# Altium project Kasli.PrjPCB (part 5 of 6)

## Sheet FPGA_I2C.SchDoc: =ProjectName
size 420 x 297 mm; Author: Paweł Kulik; CompanyName: WUT; DrawnBy: Paweł Kulik; Organization: WUT ISE; Address1: Warsaw Univeristy of Technology; Address2: Nowowiejska 15/19; DocumentNumber: 11; Revision: 2.0.1; SheetNumber: 8; SheetTotal: 11; EDA_Number: ARTIQ; Projet: ARTIQ/SINARA; ModifiedBy: -; CheckedDate: -; Title2: FPGA_I2C.SchDoc; DivGrp: ISE; Designer: Paweł Kulik; ModifiedDate: -; ProjectName: ARTIQ/SINARA
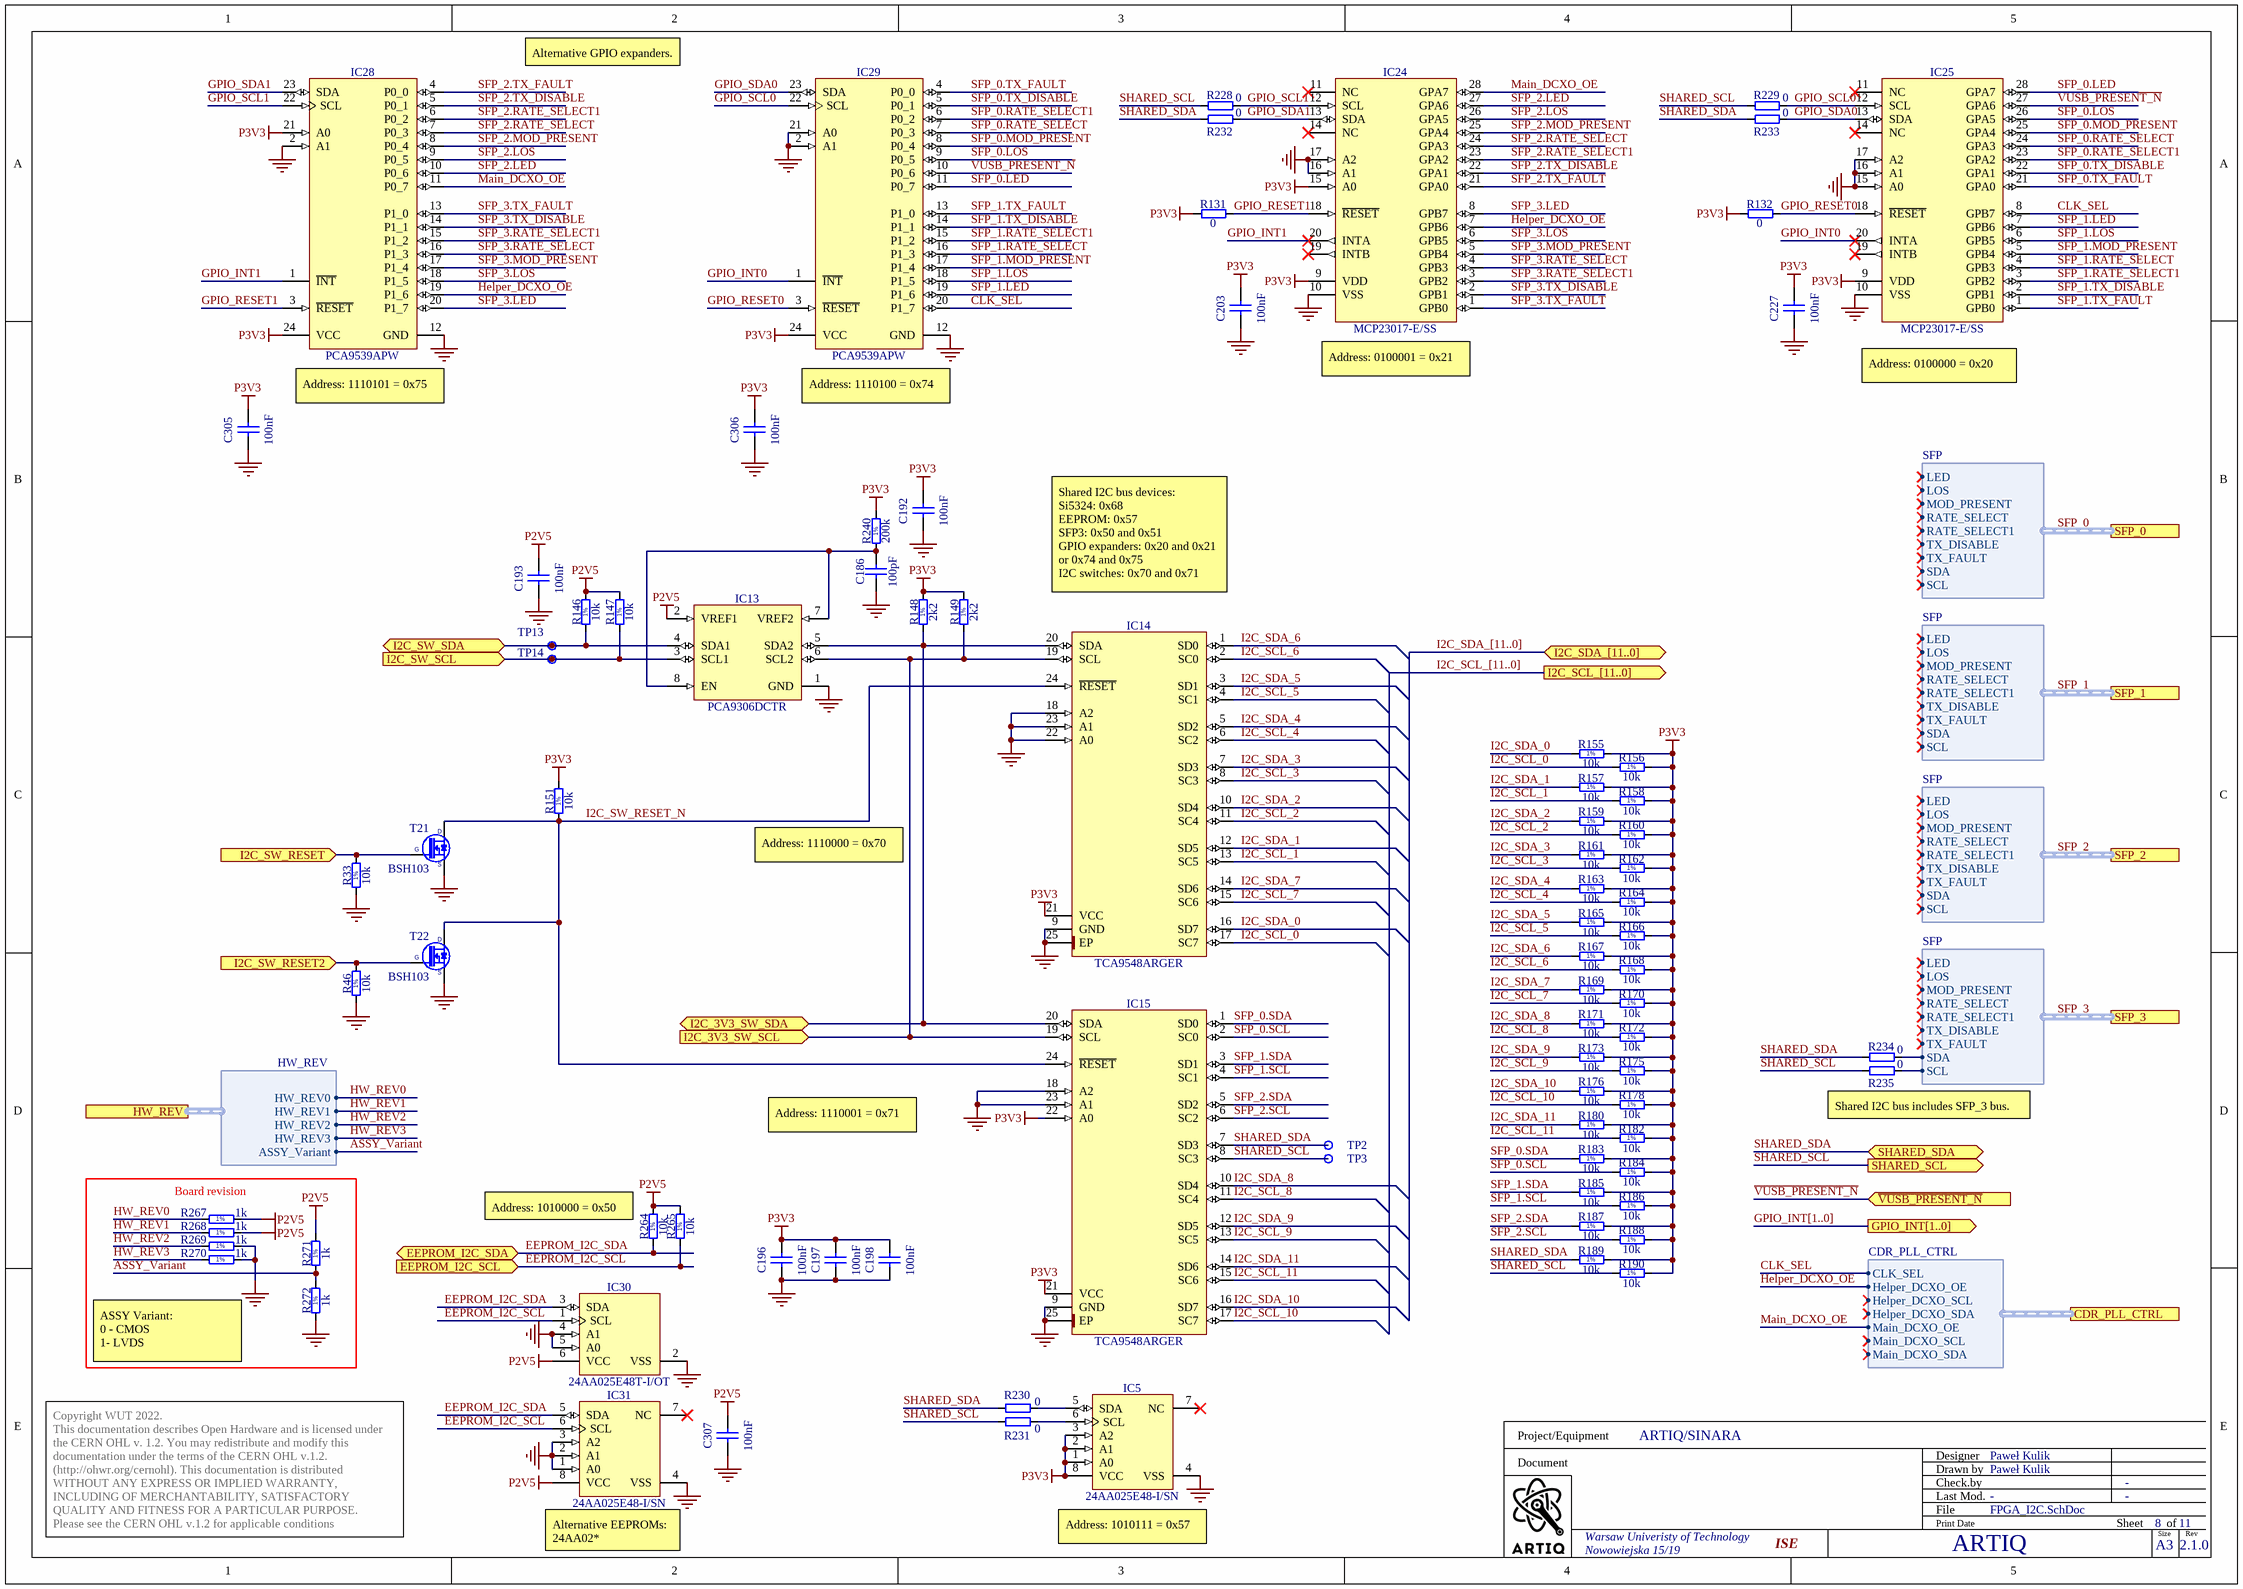
[diagram p7: FPGA_I2C.SchDoc]

### Parts
C186  100pF  [CAPC1005X55N]
C192  100nF  [CAPC0603X33N]
C193  100nF  [CAPC0603X33N]
C196  100nF  [CAPC0603X33N]
C197  100nF  [CAPC0603X33N]
C198  100nF  [CAPC0603X33N]
C203  100nF  [CAPC0603X33N]
C227  100nF  [CAPC0603X33N]
C305  100nF  [CAPC0603X33N]
C306  100nF  [CAPC0603X33N]
C307  100nF  [CAPC1005X55N]
IC5  24AA025E48-I/SN  [SOIC127P600X175-8N]
IC13  PCA9306DCTR  [SOP65P400X130-8N]
IC14  TCA9548ARGER  [QFN50P400X400X100-25N-S220]
IC15  TCA9548ARGER  [QFN50P400X400X100-25N-S220]
IC24  MCP23017-E/SS  [SOP65P780X200-28N]
IC25  MCP23017-E/SS  [SOP65P780X200-28N]
IC28  PCA9539APW  [SOP65P640X110-24N]
IC29  PCA9539APW  [SOP65P640X110-24N]
IC30  24AA025E48T-I/OT  [SOT95P280X145-6N]
IC31  24AA025E48-I/SN  [SOIC127P600X175-8N]
R33  10k  [RESC1005X40N]
R46  10k  [RESC1005X40N]
R131  0  [RESC1005X40N]
R132  0  [RESC1005X40N]
R146  10k  [RESC1005X40N]
R147  10k  [RESC1005X40N]
R148  2k2  [RESC1005X40N]
R149  2k2  [RESC1005X40N]
R151  10k  [RESC1005X40N]
R155  10k  [RESC1005X40N]
R156  10k  [RESC1005X40N]
R157  10k  [RESC1005X40N]
R158  10k  [RESC1005X40N]
R159  10k  [RESC1005X40N]
R160  10k  [RESC1005X40N]
R161  10k  [RESC1005X40N]
R162  10k  [RESC1005X40N]
R163  10k  [RESC1005X40N]
R164  10k  [RESC1005X40N]
R165  10k  [RESC1005X40N]
R166  10k  [RESC1005X40N]
R167  10k  [RESC1005X40N]
R168  10k  [RESC1005X40N]
R169  10k  [RESC1005X40N]
R170  10k  [RESC1005X40N]
R171  10k  [RESC1005X40N]
R172  10k  [RESC1005X40N]
R173  10k  [RESC1005X40N]
R175  10k  [RESC1005X40N]
R176  10k  [RESC1005X40N]
R178  10k  [RESC1005X40N]
R180  10k  [RESC1005X40N]
R182  10k  [RESC1005X40N]
R183  10k  [RESC1005X40N]
R184  10k  [RESC1005X40N]
R185  10k  [RESC1005X40N]
R186  10k  [RESC1005X40N]
R187  10k  [RESC1005X40N]
R188  10k  [RESC1005X40N]
R189  10k  [RESC1005X40N]
R190  10k  [RESC1005X40N]
R228  0  [RESC1005X40N]
R229  0  [RESC1005X40N]
R230  0  [RESC1005X40N]
R231  0  [RESC1005X40N]
R232  0  [RESC1005X40N]
R233  0  [RESC1005X40N]
R234  0  [RESC1005X40N]
R235  0  [RESC1005X40N]
R240  200k  [RESC1005X40N]
R264  10k  [RESC1005X40N]
R265  10k  [RESC1005X40N]
R267  1k  [RESC1005X40N]
R268  1k  [RESC1005X40N]
R269  1k  [RESC1005X40N]
R270  1k  [RESC1005X40N]
R271  1k  [RESC1005X40N]
R272  1k  [RESC1005X40N]
T21  BSH103  [SOT95P230X110-3N]
T22  BSH103  [SOT95P230X110-3N]
TP2  Si5324 I2C SDA  [TPS127]  (value not drawn)
TP3  Si5324 I2C SCL  [TPS127]  (value not drawn)
TP13  I2C SW SDA  [TPS127]  (value not drawn)
TP14  I2C SW SCL  [TPS127]  (value not drawn)

### Blocks framed on the sheet
Board revision: R267-R272

### Ports
CDR_PLL_CTRL (harness CDR_PLL_CTRL), EEPROM_I2C_SCL (in), EEPROM_I2C_SDA (bidir), GPIO_INT[1..0] (out), HW_REV (harness HW_REV), I2C_3V3_SW_SCL (in), I2C_3V3_SW_SDA (bidir), I2C_SCL_[11..0] (out), I2C_SDA_[11..0] (bidir), I2C_SW_RESET2 (in), I2C_SW_RESET (in), I2C_SW_SCL (in), I2C_SW_SDA (bidir), SFP_0 (harness SFP), SFP_1 (harness SFP), SFP_2 (harness SFP), SFP_3 (harness SFP), SHARED_SCL (out), SHARED_SDA (bidir), ~{VUSB_PRESENT_N} (in)

### Harnesses
SFP: LED, LOS, MOD_PRESENT, RATE_SELECT, RATE_SELECT1, TX_DISABLE, TX_FAULT, SDA, SCL
CDR_PLL_CTRL: CLK_SEL, Helper_DCXO_OE, Helper_DCXO_SCL, Helper_DCXO_SDA, Main_DCXO_OE, Main_DCXO_SCL, Main_DCXO_SDA
HW_REV: ASSY_Variant, HW_REV3, HW_REV2, HW_REV1, HW_REV0

### Nets
GND: C186.1 C192.1 C193.1 C196.1 C197.1 C198.1 C203.1 C227.1 C305.1 C306.1 C307.1 IC5.4(VSS) IC13.1(GND) IC14.9(GND) IC14.18(A2) IC14.22(A0) IC14.23(A1) IC14.25(EP) IC15.9(GND) IC15.18(A2) IC15.23(A1) IC15.25(EP) IC24.10(VSS) IC24.16(A1) IC24.17(A2) IC25.10(VSS) IC25.15(A0) IC25.16(A1) IC25.17(A2) IC28.2(A1) IC28.12(GND) IC29.2(A1) IC29.12(GND) IC29.21(A0) IC30.2(VSS) IC30.4(A1) IC30.5(A0) IC31.1(A0) IC31.2(A1) IC31.3(A2) IC31.4(VSS) R33.1 R46.1 R269.2 R270.2 R272.1 T21.2(S) T22.2(S)
P2V5: C193.2 C307.2 IC13.2(VREF1) IC30.6(VCC) IC31.8(VCC) R146.2 R147.2 R264.2 R265.2 R267.2 R268.2 R271.2
P3V3: C192.2 C196.2 C197.2 C198.2 C203.2 C227.2 C305.2 C306.2 IC5.1(A0) IC5.2(A1) IC5.3(A2) IC5.8(VCC) IC14.21(VCC) IC15.21(VCC) IC15.22(A0) IC24.9(VDD) IC24.15(A0) IC25.9(VDD) IC28.21(A0) IC28.24(VCC) IC29.24(VCC) R131.1 R132.1 R148.2 R149.2 R151.2 R155.2 R156.2 R157.2 R158.2 R159.2 R160.2 R161.2 R162.2 R163.2 R164.2 R165.2 R166.2 R167.2 R168.2 R169.2 R170.2 R171.2 R172.2 R173.2 R175.2 R176.2 R178.2 R180.2 R182.2 R183.2 R184.2 R185.2 R186.2 R187.2 R188.2 R189.2 R190.2 R240.2
~{VUSB_PRESENT_N}: IC25.27(GPA6) IC29.10(P0_6) ; port ~{VUSB_PRESENT_N}
ASSY_Variant: R271.1 R272.2 ; port HW_REV.ASSY_Variant
CLK_SEL: IC25.8(GPB7) IC29.20(P1_7) ; port CDR_PLL_CTRL.CLK_SEL
EEPROM_I2C_SCL: IC30.1(SCL) IC31.6(SCL) R265.1 ; port EEPROM_I2C_SCL
EEPROM_I2C_SDA: IC30.3(SDA) IC31.5(SDA) R264.1 ; port EEPROM_I2C_SDA
GPIO_INT0: IC25.20(INTA) IC29.1(~{INT})
GPIO_INT1: IC24.20(INTA) IC28.1(~{INT})
GPIO_RESET0: IC25.18(~{RESET}) IC29.3(~{RESET}) R132.2
GPIO_RESET1: IC24.18(~{RESET}) IC28.3(~{RESET}) R131.2
GPIO_SCL0: IC25.12(SCL) IC29.22(SCL) R229.2
GPIO_SCL1: IC24.12(SCL) IC28.22(SCL) R228.2
GPIO_SDA0: IC25.13(SDA) IC29.23(SDA) R233.2
GPIO_SDA1: IC24.13(SDA) IC28.23(SDA) R232.2
Helper_DCXO_OE: IC24.7(GPB6) IC28.19(P1_6) ; port CDR_PLL_CTRL.Helper_DCXO_OE
HW_REV0: R267.1 ; port HW_REV.HW_REV0
HW_REV1: R268.1 ; port HW_REV.HW_REV1
HW_REV2: R269.1 ; port HW_REV.HW_REV2
HW_REV3: R270.1 ; port HW_REV.HW_REV3
I2C_3V3_SW_SCL: IC13.6(SCL2) IC14.19(SCL) IC15.19(SCL) R149.1 ; port I2C_3V3_SW_SCL
I2C_3V3_SW_SDA: IC13.5(SDA2) IC14.20(SDA) IC15.20(SDA) R148.1 ; port I2C_3V3_SW_SDA
I2C_SCL_0: IC14.17(SC7) R156.1
I2C_SCL_1: IC14.13(SC5) R158.1
I2C_SCL_2: IC14.11(SC4) R160.1
I2C_SCL_3: IC14.8(SC3) R162.1
I2C_SCL_4: IC14.6(SC2) R164.1
I2C_SCL_5: IC14.4(SC1) R166.1
I2C_SCL_6: IC14.2(SC0) R168.1
I2C_SCL_7: IC14.15(SC6) R170.1
I2C_SCL_8: IC15.11(SC4) R172.1
I2C_SCL_9: IC15.13(SC5) R175.1
I2C_SCL_10: IC15.17(SC7) R178.1
I2C_SCL_11: IC15.15(SC6) R182.1
I2C_SDA_0: IC14.16(SD7) R155.1
I2C_SDA_1: IC14.12(SD5) R157.1
I2C_SDA_2: IC14.10(SD4) R159.1
I2C_SDA_3: IC14.7(SD3) R161.1
I2C_SDA_4: IC14.5(SD2) R163.1
I2C_SDA_5: IC14.3(SD1) R165.1
I2C_SDA_6: IC14.1(SD0) R167.1
I2C_SDA_7: IC14.14(SD6) R169.1
I2C_SDA_8: IC15.10(SD4) R171.1
I2C_SDA_9: IC15.12(SD5) R173.1
I2C_SDA_10: IC15.16(SD7) R176.1
I2C_SDA_11: IC15.14(SD6) R180.1
I2C_SW_RESET: R33.2 T21.1(G) ; port I2C_SW_RESET
I2C_SW_RESET2: R46.2 T22.1(G) ; port I2C_SW_RESET2
I2C_SW_RESET_N: IC14.24(~{RESET}) IC15.24(~{RESET}) R151.1 T21.3(D) T22.3(D)
I2C_SW_SCL: IC13.3(SCL1) R147.1 TP14.1 ; port I2C_SW_SCL
I2C_SW_SDA: IC13.4(SDA1) R146.1 TP13.1 ; port I2C_SW_SDA
Main_DCXO_OE: IC24.28(GPA7) IC28.11(P0_7) ; port CDR_PLL_CTRL.Main_DCXO_OE
SFP_0.LED: IC25.28(GPA7) IC29.11(P0_7)
SFP_0.LOS: IC25.26(GPA5) IC29.9(P0_5)
SFP_0.MOD_PRESENT: IC25.25(GPA4) IC29.8(P0_4)
SFP_0.RATE_SELECT: IC25.24(GPA3) IC29.7(P0_3)
SFP_0.RATE_SELECT1: IC25.23(GPA2) IC29.6(P0_2)
SFP_0.SCL: IC15.2(SC0) R184.1
SFP_0.SDA: IC15.1(SD0) R183.1
SFP_0.TX_DISABLE: IC25.22(GPA1) IC29.5(P0_1)
SFP_0.TX_FAULT: IC25.21(GPA0) IC29.4(P0_0)
SFP_1.LED: IC25.7(GPB6) IC29.19(P1_6)
SFP_1.LOS: IC25.6(GPB5) IC29.18(P1_5)
SFP_1.MOD_PRESENT: IC25.5(GPB4) IC29.17(P1_4)
SFP_1.RATE_SELECT: IC25.4(GPB3) IC29.16(P1_3)
SFP_1.RATE_SELECT1: IC25.3(GPB2) IC29.15(P1_2)
SFP_1.SCL: IC15.4(SC1) R186.1
SFP_1.SDA: IC15.3(SD1) R185.1
SFP_1.TX_DISABLE: IC25.2(GPB1) IC29.14(P1_1)
SFP_1.TX_FAULT: IC25.1(GPB0) IC29.13(P1_0)
SFP_2.LED: IC24.27(GPA6) IC28.10(P0_6)
SFP_2.LOS: IC24.26(GPA5) IC28.9(P0_5)
SFP_2.MOD_PRESENT: IC24.25(GPA4) IC28.8(P0_4)
SFP_2.RATE_SELECT: IC24.24(GPA3) IC28.7(P0_3)
SFP_2.RATE_SELECT1: IC24.23(GPA2) IC28.6(P0_2)
SFP_2.SCL: IC15.6(SC2) R188.1
SFP_2.SDA: IC15.5(SD2) R187.1
SFP_2.TX_DISABLE: IC24.22(GPA1) IC28.5(P0_1)
SFP_2.TX_FAULT: IC24.21(GPA0) IC28.4(P0_0)
SFP_3.LED: IC24.8(GPB7) IC28.20(P1_7)
SFP_3.LOS: IC24.6(GPB5) IC28.18(P1_5)
SFP_3.MOD_PRESENT: IC24.5(GPB4) IC28.17(P1_4)
SFP_3.RATE_SELECT: IC24.4(GPB3) IC28.16(P1_3)
SFP_3.RATE_SELECT1: IC24.3(GPB2) IC28.15(P1_2)
SFP_3.SCL: R235.2 ; port SFP_3.SCL
SFP_3.SDA: R234.2 ; port SFP_3.SDA
SFP_3.TX_DISABLE: IC24.2(GPB1) IC28.14(P1_1)
SFP_3.TX_FAULT: IC24.1(GPB0) IC28.13(P1_0)
SHARED_SCL: IC15.8(SC3) R190.1 R228.1 R229.1 R231.1 R235.1 TP3.1 ; port SHARED_SCL
SHARED_SDA: IC15.7(SD3) R189.1 R230.1 R232.1 R233.1 R234.1 TP2.1 ; port SHARED_SDA
NetC186_2: C186.2 IC13.7(VREF2) IC13.8(EN) R240.1
NetIC5_5: IC5.5(SDA) R230.2
NetIC5_6: IC5.6(SCL) R231.2

Not connected (* = marked no-connect by the designer): IC5 7(NC)*; IC24 11(NC)* 14(NC)* 19(INTB)*; IC25 11(NC)* 14(NC)* 19(INTB)*; IC31 7(NC)*

### Buses and harness runs
bus GPIO_INT[1..0] = port GPIO_INT[1..0]
bus I2C_SCL_[11..0] = port I2C_SCL_[11..0]
bus I2C_SDA_[11..0] = port I2C_SDA_[11..0]
harness SFP_0 = port SFP_0
harness SFP_1 = port SFP_1
harness SFP_2 = port SFP_2
harness SFP_3 = port SFP_3

### Notes on the sheet
- Alternative GPIO expanders.
- Address: 1110101 = 0x75
- Address: 1110100 = 0x74
- (near IC24) Address: 0100001 = 0x21
- (near IC25) Address: 0100000 = 0x20
- Shared I2C bus devices:
  Si5324: 0x68
  EEPROM: 0x57
  SFP3: 0x50 and 0x51
  GPIO expanders: 0x20 and 0x21 or 0x74 and 0x75
  I2C switches: 0x70 and 0x71
- Address: 1110000 = 0x70
- Address: 1110001 = 0x71
- Shared I2C bus includes SFP_3 bus.
- (near R264) Address: 1010000 = 0x50
- ASSY Variant:
  0 - CMOS
  1- LVDS
- (near IC5) Address: 1010111 = 0x57
- (near IC31) Alternative EEPROMs:
  24AA02*
- Project/Equipment
- Document
- Designer
- Drawn by
- Check.by
- Copyright WUT 2022.
  This documentation describes Open Hardware and is licensed under the CERN OHL v. 1.2. You may redistribute and modify this documentation under the terms of the CERN OHL v.1.2. (http://ohwr.org/cernohl). This documentation is distributed WITHOUT ANY EXPRESS OR IMPLIED WARRANTY, INCLUDING OF MERCHANTABILITY, SATISFACTORY QUALITY AND FITNESS FOR A PARTICULAR PURPOSE. Please see the CERN OHL v.1.2 for applicable conditions
- File
- Last Mod.
- Print Date
- Sheet
- Size
- A3
- of
- Rev
- (in symbol R0402_1K_1%_0.0625W_100PPM) 1%
- (in symbol R0402_2K2_1%_0.0625W_100PPM) 1%
- (in symbol R0402_10K_1%_0.0625W_100PPM) 1%
- (in symbol R0402_200K_1%_0.0625W_100PPM) 1%

### Library data of the parts
C186 = CC0402_100PF_50V_5%_C0G: Non-polarised capacitor; Part Description: SMD Multilayer Chip Ceramic Capacitor; Manufacturer: GENERIC; Manufacturer1 Part Number: C0402C101J5GACTU; Voltage: 50V; TC: C0G/NP0; Tolerance: ±5%; Part Number: CC0402_100PF_50V_5%_C0G; Component Kind: Standard; Component Type: Standard; Pin Count: 2; Value: 100pF; Status: Preferred; Manufacturer Part Number: CC0402_100PF_50V_5%_C0G; Case: 0402; Mounted: Yes; Socket: No; SMD: Yes; Sense: No; Manufacturer1 Example: KEMET; Manufacturer1 ComponentHeight: 0.55mm; HelpURL: \\cern.ch\dfs\Applications\Altium\Datasheets\CC0805_C0G_KEMET_(Commercial Grade).pdf; Author: CERN DEM JLC; CreateDate: 03.12.2007; LatestRevisionDate: 22.04.2015
C192 C193 C196-C198 C203 C227 C305 C306 = CC0201_100NF_6.3V_10%_X5R: as C160 on sheet SFP; Part Number: CC0201_100NF_6.3V_10%_X5R; Component Kind: Standard; Component Type: Standard; Pin Count: 2; Value: 100nF; Status: Not Recommended; Manufacturer Part Number: CC0201_100NF_6.3V_10%_X5R; Case: 0201; Mounted: Yes; Socket: No; SMD: Yes; Sense: No; Manufacturer1 Example: AVX; Manufacturer1 ComponentHeight: 0.33mm; HelpURL: \\cern.ch\dfs\Applications\Altium\Datasheets\CC0201_X5R_AVX.pdf; Author: CERN DEM JLC; CreateDate: 2007-12-03; LatestRevisionDate: 2007-12-03
C307 = CC0402_100NF_16V_10%_X5R: Non-polarised capacitor; Part Description: SMD Multilayer Chip Ceramic Capacitor; Manufacturer: GENERIC; Manufacturer1 Part Number: GRM155R61C104KA88D; Voltage: 16V; TC: X5R; Tolerance: ±10%; Part Number: CC0402_100NF_16V_10%_X5R; Component Kind: Standard; Component Type: Standard; Pin Count: 2; Value: 100nF; Status: None; Manufacturer Part Number: CC0402_100NF_16V_10%_X5R; Case: 0402; Mounted: Yes; Socket: No; SMD: Yes; Sense: No; Manufacturer1 Example: MURATA; Manufacturer1 ComponentHeight: 0.55mm; HelpURL: \\cern.ch\dfs\Applications\Altium\Datasheets\CC0402_X5R_MURATA_GRM.pdf; Author: CERN DEM JLC; CreateDate: 2013-12-10; LatestRevisionDate: 2013-12-10
IC5 IC31 = 24AA025E48-I/SN: 1.7V-5.5V, 2K I2C™ Serial EEPROMs with EUI-48™ Node Identity; Manufacturer: MICROCHIP TECHNOLOGY; PressFit: No; Bonding: No; Part Number: 24AA025E48-I/SN; Component Kind: Standard; Component Type: Standard; Device: 24AA025E48-I/SN; Part Description: 1.7V-5.5V, 2K I2C™ Serial EEPROMs with EUI-48™ Node Identity; Manufacturer Part Number: 24AA025E48-I/SN; Pin Count: 8; Case: SOIC8; Mounted: Yes; Socket: No; SMD: Yes; Sense: No; ComponentHeight: 1.75mm; HelpURL: \\cern.ch\dfs\Applications\Altium\Datasheets\24AA025E48-I-SN.pdf; Author: CERN DEM MR
  IC5: PackageDescription: SOIC 8, Pitch 1.27mm - Body 4x5mm, IPC Medium Density; CreateDate: 19.07.2016; LatestRevisionDate: 19.07.2016
  IC31: PackageDescription: SOIC, 1.27mm Pitch; 8 Pin - Body 4x5mm, IPC Medium Density; CreateDate: 2016-07-19; LatestRevisionDate: 2016-07-19
IC13 = PCA9306DCTR: Dual Bidirectional I2C Bus And SMBus Voltage-Level Translator; Manufacturer: TEXAS INSTRUMENTS; PressFit: No; Bonding: No; Part Number: PCA9306DCTR; Component Kind: Standard; Component Type: Standard; Device: PCA9306DCTR; PackageDescription: SOP, 0.65mm, Pitch; 8 Pin, 2.80mm W X 2.95mm L X 1.30mm H Body, PC Medium Density; Part Description: Dual Bidirectional I2C Bus And SMBus Voltage-Level Translator; Manufacturer Part Number: PCA9306DCTR; Pin Count: 8; Case: SSOP8; Mounted: Yes; Socket: No; SMD: Yes; Sense: No; ComponentHeight: 1.3mm; Author: CERN DEM JLC; HelpURL: \\cern.ch\dfs\Applications\Altium\Datasheets\PCA9306DCTR.pdf; CreateDate: 25.02.2013; LatestRevisionDate: 11.02.2016
IC14 IC15 = TCA9548ARGER: Low Voltage 8-Channel I2C Switch With Reset; Manufacturer: TEXAS INSTRUMENTS; PressFit: No; Bonding: No; Part Number: TCA9548ARGER; Component Kind: Standard; Component Type: Standard; Device: TCA9548ARGER; PackageDescription: QFN, 0.50mm Pitch, Square; 24 Pin, 4.00mm L X 4.00mm W X 1.00mm H body (w/thermal tab 2.2 X 2.2mm), IPC Medium Density; Part Description: Low Voltage 8-Channel I2C Switch With Reset; Manufacturer Part Number: TCA9548ARGER; Pin Count: 25; Case: QFN24; Mounted: Yes; Socket: No; SMD: Yes; Sense: No; ComponentHeight: 1mm; Author: CERN DEM JLC; HelpURL: \\cern.ch\dfs\Applications\Altium\Datasheets\TCA9548ARGER.pdf; CreateDate: 07.07.2014; LatestRevisionDate: 07.07.2014
IC24 IC25 = MCP23017-E/SS: 16-bit I/O Port Expander With Serial Interface; Manufacturer: MICROCHIP TECHNOLOGY; PressFit: No; Bonding: No; Part Number: MCP23017-E/SS; Component Kind: Standard; Component Type: Standard; Device: MCP23017-E/SS; PackageDescription: SOP, 0.65mm Pitch; 28 pin, 5.30mm W X 10.20mm L X 2.00mm H body, IPC Medium Density; Part Description: 16-bit I/O Port Expander With Serial Interface; Manufacturer Part Number: MCP23017-E/SS; Pin Count: 28; Case: SSOP28; Mounted: Yes; Socket: No; SMD: Yes; Sense: No; ComponentHeight: 2mm; Author: CERN DEM JLC; HelpURL: \\cern.ch\dfs\Applications\Altium\Datasheets\MCP23017-E-SS.pdf; CreateDate: 2011-01-17; LatestRevisionDate: 2011-01-17
IC28 IC29 = PCA9539APW: Low-Voltage 16-Bit I2C-Bus I/O Port with Interrupt and Reset; Manufacturer: NXP SEMICONDUCTORS; PressFit: No; Bonding: No; Part Number: PCA9539APW; Component Kind: Standard; Component Type: Standard; Device: PCA9539APW; PackageDescription: SOP, 0.65mm Pitch; 24 Pin, 4.40mm W X 7.80mm L X 1.10mm H body, IPC Medium Density; Part Description: Low-Voltage 16-Bit I2C-Bus I/O Port with Interrupt and Reset; Manufacturer Part Number: PCA9539APW; Pin Count: 24; Case: TSSOP24; Mounted: Yes; Socket: No; SMD: Yes; Sense: No; ComponentHeight: 1.1mm; Author: CERN DEM JMW; HelpURL: \\cern.ch\dfs\Applications\Altium\Datasheets\PCA9539APW.pdf; CreateDate: 2020-08-06; LatestRevisionDate: 2020-08-06
IC30 = 24AA025E48T-I/OT: 1.7V-5.5V, 2K I2C Serial EEPROM With EUI-48 Node Identity; Part Description: 1.7V-5.5V, 2K I2C Serial EEPROM With EUI-48™ Node Identity; Cascadable; Manufacturer: MICROCHIP TECHNOLOGY; PressFit: No; Bonding: No; Part Number: 24AA025E48T-I/OT; Component Kind: Standard; Component Type: Standard; Device: 24AA025E48T-I/OT; PackageDescription: SOT, 0.95mm pitch; 6 pin, 1.60mm W X 2.90mm L X 1.45mm H body, IPC Medium Density; Manufacturer Part Number: 24AA025E48T-I/OT; Pin Count: 6; Case: SOT23-6; Mounted: Yes; Socket: No; SMD: Yes; Sense: No; ComponentHeight: 1.45mm; HelpURL: \\cern.ch\dfs\Applications\Altium\Datasheets\24AA025E48T-I-OT.pdf; Author: CERN DEM BC; CreateDate: 2019-12-06; LatestRevisionDate: 2019-12-06
R33 R46 R146 R147 R151 R155-R173 R175 R176 R178 R180 R182-R190 R264 R265 = R0402_10K_1%_0.0625W_100PPM: Resistor - 1%; Part Description: General Purpose Thick Film Chip Resistor; Manufacturer: GENERIC; Manufacturer1 Part Number: 232270671003L; TC: ±100ppm/°C; PressFit: No; Part Number: R0402_10K_1%_0.0625W_100PPM; Component Kind: Standard; Component Type: Standard; Pin Count: 2; Value: 10k; Status: Not Recommended; Power: 0.0625W; Tolerance: ±1%; Manufacturer Part Number: R0402_10K_1%_0.0625W_100PPM; Case: 0402; Mounted: Yes; Sense: No; Socket: No; SMD: Yes; Manufacturer1 Example: YAGEO PHYCOMP; Manufacturer1 ComponentHeight: 0.4mm; HelpURL: \\cern.ch\dfs\Applications\Altium\Datasheets\R0402_Phycomp_RC0402.pdf; Author: CERN DEM JLC; CreateDate: 03.12.2007; LatestRevisionDate: 17.10.2012
R131 R132 R228-R235 = R0402_0R_JUMPER: Resistor; Part Description: 1A (0.05R Max DC Resistance) Zero Ohm Jumper; Manufacturer: GENERIC; Manufacturer1 Part Number: 232270591001L; PressFit: No; Part Number: R0402_0R_JUMPER; Component Kind: Standard; Component Type: Standard; Pin Count: 2; Value: 0; Status: Not Recommended; Manufacturer Part Number: R0402_0R_JUMPER; Case: 0402; Mounted: Yes; Sense: No; Socket: No; SMD: Yes; Manufacturer1 Example: YAGEO PHYCOMP; Manufacturer1 ComponentHeight: 0.4mm; HelpURL: \\cern.ch\dfs\Applications\Altium\Datasheets\R0402_Phycomp_RC0402.pdf; Author: CERN DEM JLC
  R131 R132: CreateDate: 2007-12-03; LatestRevisionDate: 2012-10-17
  R228-R235: CreateDate: 03.12.2007; LatestRevisionDate: 17.10.2012
R148 R149 = R0402_2K2_1%_0.0625W_100PPM: Resistor - 1%; Part Description: General Purpose Thick Film Chip Resistor; Manufacturer: GENERIC; Manufacturer1 Part Number: 232270672202L; TC: ±100ppm/°C; PressFit: No; Part Number: R0402_2K2_1%_0.0625W_100PPM; Component Kind: Standard; Component Type: Standard; Pin Count: 2; Value: 2k2; Status: Not Recommended; Power: 0.0625W; Tolerance: ±1%; Manufacturer Part Number: R0402_2K2_1%_0.0625W_100PPM; Case: 0402; Mounted: Yes; Sense: No; Socket: No; SMD: Yes; Manufacturer1 Example: YAGEO PHYCOMP; Manufacturer1 ComponentHeight: 0.4mm; HelpURL: \\cern.ch\dfs\Applications\Altium\Datasheets\R0402_Phycomp_RC0402.pdf; Author: CERN DEM JLC; CreateDate: 03.12.2007; LatestRevisionDate: 17.10.2012
R240 = R0402_200K_1%_0.0625W_100PPM: Resistor - 1%; Part Description: General Purpose Thick Film Chip Resistor; Manufacturer: GENERIC; Manufacturer1 Part Number: 232270672004L; TC: ±100ppm/°C; PressFit: No; Part Number: R0402_200K_1%_0.0625W_100PPM; Component Kind: Standard; Component Type: Standard; Pin Count: 2; Value: 200k; Status: Not Recommended; Power: 0.0625W; Tolerance: ±1%; Manufacturer Part Number: R0402_200K_1%_0.0625W_100PPM; Case: 0402; Mounted: Yes; Sense: No; Socket: No; SMD: Yes; Manufacturer1 Example: YAGEO PHYCOMP; Manufacturer1 ComponentHeight: 0.4mm; HelpURL: \\cern.ch\dfs\Applications\Altium\Datasheets\R0402_Phycomp_RC0402.pdf; Author: CERN DEM JLC; CreateDate: 03.12.2007; LatestRevisionDate: 17.10.2012
R267-R272 = R0402_1K_1%_0.0625W_100PPM: Resistor - 1%; Part Description: General Purpose Thick Film Chip Resistor; Manufacturer: GENERIC; Manufacturer1 Part Number: 232270671002L; TC: ±100ppm/°C; PressFit: No; Part Number: R0402_1K_1%_0.0625W_100PPM; Component Kind: Standard; Component Type: Standard; Pin Count: 2; Value: 1k; Status: Not Recommended; Power: 0.0625W; Tolerance: ±1%; Manufacturer Part Number: R0402_1K_1%_0.0625W_100PPM; Case: 0402; Mounted: Yes; Sense: No; Socket: No; SMD: Yes; Manufacturer1 Example: YAGEO PHYCOMP; Manufacturer1 ComponentHeight: 0.4mm; HelpURL: \\cern.ch\dfs\Applications\Altium\Datasheets\R0402_Phycomp_RC0402.pdf; Author: CERN DEM JLC; CreateDate: 03.12.2007; LatestRevisionDate: 17.10.2012
T21 T22 = BSH103: N-CHANNEL MOSFET WITH DIODE; Part Description: 30V 850mA N-Channel Enhancement Mode Field-Effect Transistor; Manufacturer: NEXPERIA; PressFit: No; Bonding: No; Part Number: BSH103; Component Kind: Standard; Component Type: Standard; Device: BSH103; PackageDescription: SOT23, 3 pin, Pitch 0.95mm - 1.3mm W X 2.9mm L X 1.1mm H, IPC Medium Density; Manufacturer Part Number: BSH103; Pin Count: 3; Case: SOT23-3; Mounted: Yes; Socket: No; SMD: Yes; Sense: No; ComponentHeight: 1.1mm; HelpURL: \\cern.ch\dfs\Applications\Altium\Datasheets\BSH103.pdf; Author: CERN DEM JLC; CreateDate: 16.03.2010; LatestRevisionDate: 20.06.2017; ClassName: Artix
TP2 TP3 TP13 TP14 = SMD_PAD_1.27X1.27MM: Test Point; Part Description: 1.27mm x 1.27mm PCB Copper Area (SMD Test Point); Mounted: No; Part Number: SMD_PAD_1.27X1.27MM; Component Kind: Standard (No BOM); Component Type: Standard (No BOM); Pin Count: 1; Family: Test Point; Socket: No; SMD: Yes; Sense: No; Status: None; ComponentHeight: 0mm; HelpURL: Undefined; Author: CERN DEM JLC; CreateDate: 12.01.2008; LatestRevisionDate: 12.01.2008; PackageDescription: 1.27mm x 1.27mm PCB Copper Area (SMD Test Point)

## Sheet FPGA_SDRAM.SchDoc: =ProjectName
size 420 x 297 mm; Author: G.K.; CompanyName: WUT; DrawnBy: G.K. and P.K.; Organization: WUT ISE; Address1: Warsaw Univeristy of Technology; Address2: Nowowiejska 15/19; DocumentNumber: 8; Revision: 2.0.1; SheetNumber: 3; SheetTotal: 11; EDA_Number: ARTIQ; Projet: ARTIQ/SINARA; ModifiedBy: -; CheckedDate: -; Title2: FPGA_SDRAM.SchDoc; DivGrp: ISE; Designer: G.K. and P.K.; ModifiedDate: -; ProjectName: ARTIQ/SINARA
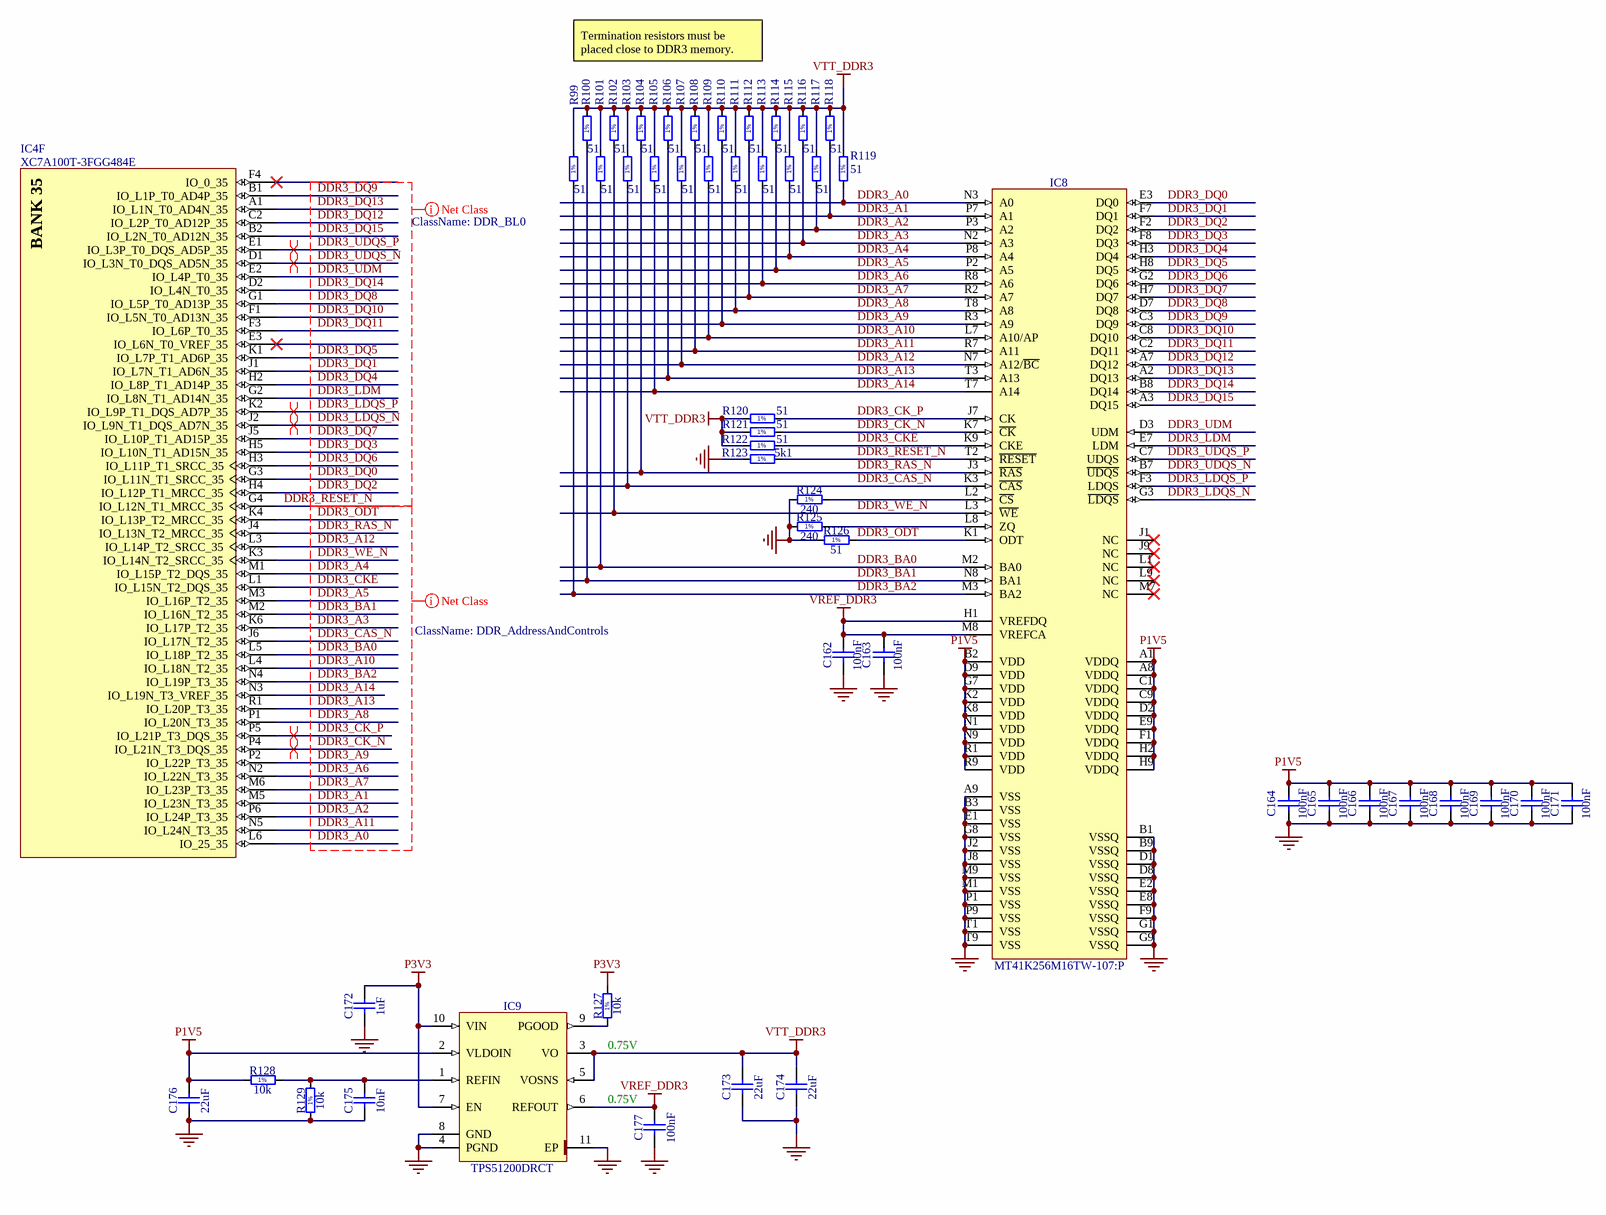
[diagram p8: FPGA_SDRAM.SchDoc]

### Parts
C162  100nF  [CAPC0603X33N]
C163  100nF  [CAPC0603X33N]
C164  100nF  [CAPC0603X33N]
C165  100nF  [CAPC0603X33N]
C166  100nF  [CAPC0603X33N]
C167  100nF  [CAPC0603X33N]
C168  100nF  [CAPC0603X33N]
C169  100nF  [CAPC0603X33N]
C170  100nF  [CAPC0603X33N]
C171  100nF  [CAPC0603X33N]
C172  1uF  [CAPC1005X55N]
C173  22uF  [CAPC1709X100N]
C174  22uF  [CAPC1709X100N]
C175  10nF  [CAPC1005X55N]
C176  22uF  [CAPC1709X100N]
C177  100nF  [CAPC0603X33N]
IC4  XC7A100T-3FGG484E  [BGA484C100P22X22_2300X2300X260]  (part F of 10)
IC8  MT41K256M16TW-107:P  [BGA96C80P9X16_800X1400X120]
IC9  TPS51200DRCT  [TEXAS_DRC (S-PVSON-N10)]
R99  51  [RESC1005X40N]
R100  51  [RESC1005X40N]
R101  51  [RESC1005X40N]
R102  51  [RESC1005X40N]
R103  51  [RESC1005X40N]
R104  51  [RESC1005X40N]
R105  51  [RESC1005X40N]
R106  51  [RESC1005X40N]
R107  51  [RESC1005X40N]
R108  51  [RESC1005X40N]
R109  51  [RESC1005X40N]
R110  51  [RESC1005X40N]
R111  51  [RESC1005X40N]
R112  51  [RESC1005X40N]
R113  51  [RESC1005X40N]
R114  51  [RESC1005X40N]
R115  51  [RESC1005X40N]
R116  51  [RESC1005X40N]
R117  51  [RESC1005X40N]
R118  51  [RESC1005X40N]
R119  51  [RESC1005X40N]
R120  51  [RESC1005X40N]
R121  51  [RESC1005X40N]
R122  51  [RESC1005X40N]
R123  5k1  [RESC1005X40N]
R124  240  [RESC1005X40N]
R125  240  [RESC1005X40N]
R126  51  [RESC1005X40N]
R127  10k  [RESC1005X40N]
R128  10k  [RESC1005X40N]
R129  10k  [RESC1005X40N]

### Nets
GND: C162.1 C163.1 C164.1 C165.1 C166.1 C167.1 C168.1 C169.1 C170.1 C171.1 C172.1 C173.1 C174.1 C175.1 C176.1 C177.1 IC8.A9(VSS) IC8.B1(VSSQ) IC8.B3(VSS) IC8.B9(VSSQ) IC8.D1(VSSQ) IC8.D8(VSSQ) IC8.E1(VSS) IC8.E2(VSSQ) IC8.E8(VSSQ) IC8.F9(VSSQ) IC8.G1(VSSQ) IC8.G8(VSS) IC8.G9(VSSQ) IC8.J2(VSS) IC8.J8(VSS) IC8.M1(VSS) IC8.M9(VSS) IC8.P1(VSS) IC8.P9(VSS) IC8.T1(VSS) IC8.T9(VSS) IC9.4(PGND) IC9.8(GND) IC9.11(EP) R123.1 R124.1 R125.1 R126.1 R129.1
P1V5: C164.2 C165.2 C166.2 C167.2 C168.2 C169.2 C170.2 C171.2 C176.2 IC8.A1(VDDQ) IC8.A8(VDDQ) IC8.B2(VDD) IC8.C1(VDDQ) IC8.C9(VDDQ) IC8.D2(VDDQ) IC8.D9(VDD) IC8.E9(VDDQ) IC8.F1(VDDQ) IC8.G7(VDD) IC8.H2(VDDQ) IC8.H9(VDDQ) IC8.K2(VDD) IC8.K8(VDD) IC8.N1(VDD) IC8.N9(VDD) IC8.R1(VDD) IC8.R9(VDD) IC9.2(VLDOIN) R128.1
P3V3: C172.2 IC9.7(EN) IC9.10(VIN) R127.2
VREF_DDR3: C162.2 C163.2 C177.2 IC8.H1(VREFDQ) IC8.M8(VREFCA) IC9.6(REFOUT)
VTT_DDR3: C173.2 C174.2 IC9.3(VO) IC9.5(VOSNS) R99.2 R100.2 R101.2 R102.2 R103.2 R104.2 R105.2 R106.2 R107.2 R108.2 R109.2 R110.2 R111.2 R112.2 R113.2 R114.2 R115.2 R116.2 R117.2 R118.2 R119.2 R120.1 R121.1 R122.1
DDR3_A0: IC4.L6(IO_25_35) IC8.N3(A0) R119.1
DDR3_A1: IC4.M5(IO_L23N_T3_35) IC8.P7(A1) R118.1
DDR3_A2: IC4.P6(IO_L24P_T3_35) IC8.P3(A2) R117.1
DDR3_A3: IC4.K6(IO_L17P_T2_35) IC8.N2(A3) R116.1
DDR3_A4: IC4.M1(IO_L15P_T2_DQS_35) IC8.P8(A4) R115.1
DDR3_A5: IC4.M3(IO_L16P_T2_35) IC8.P2(A5) R114.1
DDR3_A6: IC4.N2(IO_L22N_T3_35) IC8.R8(A6) R113.1
DDR3_A7: IC4.M6(IO_L23P_T3_35) IC8.R2(A7) R112.1
DDR3_A8: IC4.P1(IO_L20N_T3_35) IC8.T8(A8) R111.1
DDR3_A9: IC4.P2(IO_L22P_T3_35) IC8.R3(A9) R110.1
DDR3_A10: IC4.L4(IO_L18N_T2_35) IC8.L7(A10/AP) R109.1
DDR3_A11: IC4.N5(IO_L24N_T3_35) IC8.R7(A11) R108.1
DDR3_A12: IC4.L3(IO_L14P_T2_SRCC_35) IC8.N7(A12/~{BC}) R107.1
DDR3_A13: IC4.R1(IO_L20P_T3_35) IC8.T3(A13) R106.1
DDR3_A14: IC4.N3(IO_L19N_T3_VREF_35) IC8.T7(A14) R105.1
DDR3_BA0: IC4.L5(IO_L18P_T2_35) IC8.M2(BA0) R101.1
DDR3_BA1: IC4.M2(IO_L16N_T2_35) IC8.N8(BA1) R100.1
DDR3_BA2: IC4.N4(IO_L19P_T3_35) IC8.M3(BA2) R99.1
DDR3_CAS_N: IC4.J6(IO_L17N_T2_35) IC8.K3(~{CAS}) R103.1
DDR3_CK_N: IC4.P4(IO_L21N_T3_DQS_35) IC8.K7(~{CK}) R121.2
DDR3_CK_P: IC4.P5(IO_L21P_T3_DQS_35) IC8.J7(CK) R120.2
DDR3_CKE: IC4.L1(IO_L15N_T2_DQS_35) IC8.K9(CKE) R122.2
DDR3_DQ0: IC4.G3(IO_L11N_T1_SRCC_35) IC8.E3(DQ0)
DDR3_DQ1: IC4.J1(IO_L7N_T1_AD6N_35) IC8.F7(DQ1)
DDR3_DQ2: IC4.H4(IO_L12P_T1_MRCC_35) IC8.F2(DQ2)
DDR3_DQ3: IC4.H5(IO_L10N_T1_AD15N_35) IC8.F8(DQ3)
DDR3_DQ4: IC4.H2(IO_L8P_T1_AD14P_35) IC8.H3(DQ4)
DDR3_DQ5: IC4.K1(IO_L7P_T1_AD6P_35) IC8.H8(DQ5)
DDR3_DQ6: IC4.H3(IO_L11P_T1_SRCC_35) IC8.G2(DQ6)
DDR3_DQ7: IC4.J5(IO_L10P_T1_AD15P_35) IC8.H7(DQ7)
DDR3_DQ8: IC4.G1(IO_L5P_T0_AD13P_35) IC8.D7(DQ8)
DDR3_DQ9: IC4.B1(IO_L1P_T0_AD4P_35) IC8.C3(DQ9)
DDR3_DQ10: IC4.F1(IO_L5N_T0_AD13N_35) IC8.C8(DQ10)
DDR3_DQ11: IC4.F3(IO_L6P_T0_35) IC8.C2(DQ11)
DDR3_DQ12: IC4.C2(IO_L2P_T0_AD12P_35) IC8.A7(DQ12)
DDR3_DQ13: IC4.A1(IO_L1N_T0_AD4N_35) IC8.A2(DQ13)
DDR3_DQ14: IC4.D2(IO_L4N_T0_35) IC8.B8(DQ14)
DDR3_DQ15: IC4.B2(IO_L2N_T0_AD12N_35) IC8.A3(DQ15)
DDR3_LDM: IC4.G2(IO_L8N_T1_AD14N_35) IC8.E7(LDM)
DDR3_LDQS_N: IC4.J2(IO_L9N_T1_DQS_AD7N_35) IC8.G3(~{LDQS})
DDR3_LDQS_P: IC4.K2(IO_L9P_T1_DQS_AD7P_35) IC8.F3(LDQS)
DDR3_ODT: IC4.K4(IO_L13P_T2_MRCC_35) IC8.K1(ODT) R126.2
DDR3_RAS_N: IC4.J4(IO_L13N_T2_MRCC_35) IC8.J3(~{RAS}) R104.1
DDR3_RESET_N: IC4.G4(IO_L12N_T1_MRCC_35) IC8.T2(~{RESET}) R123.2
DDR3_UDM: IC4.E2(IO_L4P_T0_35) IC8.D3(UDM)
DDR3_UDQS_N: IC4.D1(IO_L3N_T0_DQS_AD5N_35) IC8.B7(~{UDQS})
DDR3_UDQS_P: IC4.E1(IO_L3P_T0_DQS_AD5P_35) IC8.C7(UDQS)
DDR3_WE_N: IC4.K3(IO_L14N_T2_SRCC_35) IC8.L3(~{WE}) R102.1
NetC175_2: C175.2 IC9.1(REFIN) R128.2 R129.2
NetIC8_L2: IC8.L2(~{CS}) R124.2
NetIC8_L8: IC8.L8(ZQ) R125.2
NetIC9_9: IC9.9(PGOOD) R127.1

Not connected (* = marked no-connect by the designer): IC4 E3(IO_L6N_T0_VREF_35)* F4(IO_0_35)*; IC8 J1(NC)* J9(NC)* L1(NC)* L9(NC)* M7(NC)*

### Layout directives
differential pair; differential pair class Diff_100Ohm: DDR3_CK_N, DDR3_CK_P, DDR3_LDQS_N, DDR3_LDQS_P, DDR3_UDQS_N, DDR3_UDQS_P
net class DDR_AddressAndControls; net class 50Ohm: DDR3_A0, DDR3_A1, DDR3_A2, DDR3_A3, DDR3_A4, DDR3_A5, DDR3_A6, DDR3_A7, DDR3_A8, DDR3_A9, DDR3_A10, DDR3_A11, DDR3_A12, DDR3_A13, DDR3_A14, DDR3_BA0, DDR3_BA1, DDR3_BA2, DDR3_CAS_N, DDR3_CK_N, DDR3_CK_P, DDR3_CKE, DDR3_ODT, DDR3_RAS_N, DDR3_WE_N
net class DDR_BL0; net class 50Ohm: DDR3_DQ0, DDR3_DQ1, DDR3_DQ2, DDR3_DQ3, DDR3_DQ4, DDR3_DQ5, DDR3_DQ6, DDR3_DQ7, DDR3_DQ8, DDR3_DQ9, DDR3_DQ10, DDR3_DQ11, DDR3_DQ12, DDR3_DQ13, DDR3_DQ14, DDR3_DQ15, DDR3_LDM, DDR3_LDQS_N, DDR3_LDQS_P, DDR3_UDM, DDR3_UDQS_N, DDR3_UDQS_P

### Notes on the sheet
- Termination resistors must be placed close to DDR3 memory.
- (near R127) 0.75V
- (near C177) 0.75V
- Project/Equipment
- Document
- Designer
- Drawn by
- Check.by
- Copyright WUT 2022.
  This documentation describes Open Hardware and is licensed under the CERN OHL v. 1.2. You may redistribute and modify this documentation under the terms of the CERN OHL v.1.2. (http://ohwr.org/cernohl). This documentation is distributed WITHOUT ANY EXPRESS OR IMPLIED WARRANTY, INCLUDING OF MERCHANTABILITY, SATISFACTORY QUALITY AND FITNESS FOR A PARTICULAR PURPOSE. Please see the CERN OHL v.1.2 for applicable conditions
- File
- Last Mod.
- Print Date
- Sheet
- Size
- A3
- of
- Rev
- (in symbol R0402_5K1_1%_0.0625W_100PPM) 1%
- (in symbol R0402_10K_1%_0.0625W_100PPM) 1%
- (in symbol R0402_51R_1%_0.0625W_100PPM) 1%
- (in symbol R0402_240R_1%_0.0625W_100PPM) 1%
- (in symbol XC7A100T-3FGG484E, part F) BANK 35

### Library data of the parts
C162-C171 C177 = CC0201_100NF_6.3V_10%_X5R: as C160 on sheet SFP; Part Number: CC0201_100NF_6.3V_10%_X5R; Component Kind: Standard; Component Type: Standard; Pin Count: 2; Value: 100nF; Status: Not Recommended; Manufacturer Part Number: CC0201_100NF_6.3V_10%_X5R; Case: 0201; Mounted: Yes; Socket: No; SMD: Yes; Sense: No; Manufacturer1 Example: AVX; Manufacturer1 ComponentHeight: 0.33mm; HelpURL: \\cern.ch\dfs\Applications\Altium\Datasheets\CC0201_X5R_AVX.pdf; Author: CERN DEM JLC
  C162-C171: CreateDate: 2007-12-03; LatestRevisionDate: 2007-12-03
  C177: CreateDate: 03.12.2007; LatestRevisionDate: 03.12.2007
C172 = CC0402_1UF_16V_10%_X5R: Non-polarised capacitor; Part Description: SMD Multilayer Chip Ceramic Capacitor; Manufacturer: GENERIC; Manufacturer1 Part Number: C1005X5R1C105KT; Voltage: 16V; TC: X5R; Tolerance: ±10%; Part Number: CC0402_1UF_16V_10%_X5R; Component Kind: Standard; Component Type: Standard; Pin Count: 2; Value: 1uF; Status: Preferred; Manufacturer Part Number: CC0402_1UF_16V_10%_X5R; Case: 0402; Mounted: Yes; Socket: No; SMD: Yes; Manufacturer1 Example: TDK; Manufacturer1 ComponentHeight: 0.55mm; HelpURL: \\cern.ch\dfs\Applications\Altium\Datasheets\CC0402_X5R_TDK_C.pdf; Author: CERN DEM JLC; CreateDate: 25.10.2012; LatestRevisionDate: 25.10.2012; Sense: No
C173 C174 C176 = CC0603_22UF_6.3V_20%_X5R: Non-polarised capacitor; Part Description: SMD Multilayer Chip Ceramic Capacitor; Manufacturer: GENERIC; Manufacturer1 Part Number: C1608X5R0J226M080AC; Voltage: 6.3V; TC: X5R; Tolerance: ±20%; Part Number: CC0603_22UF_6.3V_20%_X5R; Component Kind: Standard; Component Type: Standard; Pin Count: 2; Value: 22uF; Status: None; Manufacturer Part Number: CC0603_22UF_6.3V_20%_X5R; Case: 0603; Mounted: Yes; Socket: No; SMD: Yes; Manufacturer1 Example: TDK; Manufacturer1 ComponentHeight: 1mm; HelpURL: \\cern.ch\dfs\Applications\Altium\Datasheets\CC0603_X5R_TDK_C.pdf; Author: CERN DEM JLC; CreateDate: 16.12.2013; LatestRevisionDate: 13.09.2016; Sense: No
C175 = CC0402_10NF_16V_10%_X7R: Non-polarised capacitor; Part Description: SMD Multilayer Chip Ceramic Capacitor; Manufacturer: GENERIC; Manufacturer1 Part Number: 223878715636; Voltage: 16V; TC: X7R; Tolerance: ±10%; Part Number: CC0402_10NF_16V_10%_X7R; Component Kind: Standard; Component Type: Standard; Pin Count: 2; Value: 10nF; Status: Not Recommended; Manufacturer Part Number: CC0402_10NF_16V_10%_X7R; Case: 0402; Mounted: Yes; Socket: No; SMD: Yes; Manufacturer1 Example: PHYCOMP; Manufacturer1 ComponentHeight: 0.55mm; HelpURL: \\cern.ch\dfs\Applications\Altium\Datasheets\CC0402_X7R_PHYCOMP.pdf; Author: CERN DEM JLC; CreateDate: 03.12.2007; LatestRevisionDate: 03.12.2007; Sense: No
IC4 = XC7A100T-3FGG484E: Artix-7 FPGA, 285 User I/Os, 4 GTP, 484-Ball BGA, Speed Grade 3, Extended Temperature Grade, Pb-Free; Manufacturer: XILINX; PressFit: No; Bonding: No; PackageDescription: BGA, 1.00mm Pitch, Square; 484 Pin, 22 Columns X 22 Rows, Body 23.00mm X 23.00mm X 2.60mm H, IPC Medium Density; ComponentLink2Description: Pinout; ComponentLink2URL: \\cern.ch\dfs\Applications\Altium\Datasheets\XC7A100T-3FGG484E_Pinout.pdf; ComponentLink1URL: \\cern.ch\dfs\Applications\Altium\Datasheets\XC7A100T-3FGG484E_Package-Pinout.pdf; ComponentLink1Description: Package/Pinout; Part Number: XC7A100T-3FGG484E; Component Kind: Standard; Component Type: Standard; Device: XC7A100T-3FGG484E; Part Description: Artix-7 FPGA, 285 User I/Os, 4 GTP, 484-Ball BGA, Speed Grade 3, Extended Temperature Grade, Pb-Free; Manufacturer Part Number: XC7A100T-3FGG484E; Pin Count: 484; Case: BGA484; Mounted: Yes; Socket: No; SMD: Yes; Sense: No; ComponentHeight: 2.6mm; HelpURL: \\cern.ch\dfs\Applications\Altium\Datasheets\XC7A100T-3FGG484E.pdf; Author: CERN DEM BC; CreateDate: 18.10.2019; LatestRevisionDate: 18.10.2019
IC8 = MT41K256M16TW-107:P: 32 Meg x 16 x 8 Banks DDR3L SDRAM; Part Description: +1.5V, 4Gb (32Meg x 16 x 8 banks) DDR3L SDRAM; Manufacturer: MICRON TECHNOLOGY; PressFit: No; Bonding: No; Part Number: MT41K256M16TW-107:P; Component Kind: Standard; Component Type: Standard; Device: MT41K256M16TW-107:P; PackageDescription: BGA 0.8mm, Pitch, Square 96 Pin, 9 Columns x 16 Rows, Body 14mm X 8mm X 1.2mm H; Manufacturer Part Number: MT41K256M16TW-107:P; Pin Count: 96; Case: BGA96; Mounted: Yes; Socket: No; SMD: Yes; Sense: No; ComponentHeight: 1.2mm; HelpURL: \\cern.ch\dfs\Applications\Altium\Datasheets\MT41K256M16TW-107-P.pdf; Author: CERN DEM MR; CreateDate: 2015-12-14; LatestRevisionDate: 2015-12-14
IC9 = TPS51200DRCT: Sink/Source DDR Termination Regulator; Part Description: 3.3V Sink/Source DDR Termination Regulator; Manufacturer: TEXAS INSTRUMENTS; PressFit: No; Bonding: No; Part Number: TPS51200DRCT; Component Kind: Standard; Component Type: Standard; Device: TPS51200DRCT; PackageDescription: SON, 0.50mm Pitch, 10-pin, 3.00mm W  X 3.00mm L X 1.00mm Height, (w/thermal tab 1.75 X 2.50 mm); Manufacturer Part Number: TPS51200DRCT; Pin Count: 11; Case: SON10; Mounted: Yes; Socket: No; SMD: Yes; Sense: No; ComponentHeight: 1mm; HelpURL: \\cern.ch\dfs\Applications\Altium\Datasheets\TPS51200DRCT.pdf; Author: CERN DEM JLC; CreateDate: 03.02.2010; LatestRevisionDate: 06.11.2013
R99-R121 = R0402_51R_1%_0.0625W_100PPM: Resistor - 1%; Part Description: General Purpose Thick Film Chip Resistor; Manufacturer: GENERIC; Manufacturer1 Part Number: 232270675109; TC: ±100ppm/°C; Table: Resistors SMD; Part Number: R0402_51R_1%_0.0625W_100PPM; Component Kind: Standard; Component Type: Standard; Pin Count: 2; Value: 51; Status: Not recommended; Power: 0.0625W; Tolerance: ±1%; Manufacturer Part Number: R0402_51R_1%_0.0625W_100PPM; Mounted: Yes; Socket: No; SMD: Yes; Manufacturer1 Example: PHYCOMP; Manufacturer1 ComponentHeight: 0.4mm; HelpURL: \\cern.ch\dfs\Applications\Altium\Datasheets\R0402_Phycomp_RC0402.pdf; Author: CERN DEM JLC; CreateDate: 03/12/2007; LatestRevisionDate: 13/03/2008
  R99-R118 R120 R121: Case: 0402
R122 R126 = R0402_51R_1%_0.0625W_100PPM: Resistor - 1%; Part Description: General Purpose Thick Film Chip Resistor; Manufacturer: GENERIC; Manufacturer1 Part Number: 232270675109L; TC: ±100ppm/°C; PressFit: No; Part Number: R0402_51R_1%_0.0625W_100PPM; Component Kind: Standard; Component Type: Standard; Pin Count: 2; Value: 51; Status: Not Recommended; Power: 0.0625W; Tolerance: ±1%; Manufacturer Part Number: R0402_51R_1%_0.0625W_100PPM; Case: 0402; Mounted: Yes; Sense: No; Socket: No; SMD: Yes; Manufacturer1 Example: YAGEO PHYCOMP; Manufacturer1 ComponentHeight: 0.4mm; HelpURL: \\cern.ch\dfs\Applications\Altium\Datasheets\R0402_Phycomp_RC0402.pdf; Author: CERN DEM JLC; CreateDate: 2007-12-03; LatestRevisionDate: 2012-10-17
R123 = R0402_5K1_1%_0.0625W_100PPM: Resistor - 1%; Part Description: General Purpose Thick Film Chip Resistor; Manufacturer: GENERIC; Manufacturer1 Part Number: 232270675102L; TC: ±100ppm/°C; PressFit: No; Part Number: R0402_5K1_1%_0.0625W_100PPM; Component Kind: Standard; Component Type: Standard; Pin Count: 2; Value: 5k1; Status: Not Recommended; Power: 0.0625W; Tolerance: ±1%; Manufacturer Part Number: R0402_5K1_1%_0.0625W_100PPM; Case: 0402; Mounted: Yes; Sense: No; Socket: No; SMD: Yes; Manufacturer1 Example: YAGEO PHYCOMP; Manufacturer1 ComponentHeight: 0.4mm; HelpURL: \\cern.ch\dfs\Applications\Altium\Datasheets\R0402_Phycomp_RC0402.pdf; Author: CERN DEM JLC; CreateDate: 03.12.2007; LatestRevisionDate: 17.10.2012
R124 R125 = R0402_240R_1%_0.0625W_100PPM: Resistor - 1%; Part Description: General Purpose Thick Film Chip Resistor; Manufacturer: GENERIC; Manufacturer1 Part Number: 232270672401L; TC: ±100ppm/°C; PressFit: No; Part Number: R0402_240R_1%_0.0625W_100PPM; Component Kind: Standard; Component Type: Standard; Pin Count: 2; Value: 240; Status: Not Recommended; Power: 0.0625W; Tolerance: ±1%; Manufacturer Part Number: R0402_240R_1%_0.0625W_100PPM; Case: 0402; Mounted: Yes; Sense: No; Socket: No; SMD: Yes; Manufacturer1 Example: YAGEO PHYCOMP; Manufacturer1 ComponentHeight: 0.4mm; HelpURL: \\cern.ch\dfs\Applications\Altium\Datasheets\R0402_Phycomp_RC0402.pdf; Author: CERN DEM JLC; CreateDate: 03.12.2007; LatestRevisionDate: 17.10.2012
R127-R129 = R0402_10K_1%_0.0625W_100PPM: as R33 on sheet FPGA_I2C; Part Number: R0402_10K_1%_0.0625W_100PPM; Component Kind: Standard; Component Type: Standard; Pin Count: 2; Value: 10k; Status: Not Recommended; Power: 0.0625W; Tolerance: ±1%; Manufacturer Part Number: R0402_10K_1%_0.0625W_100PPM; Case: 0402; Mounted: Yes; Socket: No; SMD: Yes; Manufacturer1 Example: YAGEO PHYCOMP; Manufacturer1 ComponentHeight: 0.4mm; HelpURL: \\cern.ch\dfs\Applications\Altium\Datasheets\R0402_Phycomp_RC0402.pdf; Author: CERN DEM JLC; CreateDate: 03.12.2007; LatestRevisionDate: 17.10.2012; Sense: No

## Sheet IDC_EXT_Connectors.SchDoc: =ProjectName
size 420 x 297 mm; Author: Paweł Kulik; CompanyName: WUT; DrawnBy: Paweł Kulik; Organization: WUT ISE; Address1: Warsaw Univeristy of Technology; Address2: Nowowiejska 15/19; DocumentNumber: 3; Revision: 2.0; SheetNumber: 11; SheetTotal: 11; EDA_Number: ARTIQ; Projet: ARTIQ/SINARA; ModifiedBy: -; CheckedDate: -; Title2: IDC_EXT_Connectors.SchDoc; DivGrp: ISE; Designer: Paweł Kulik; ModifiedDate: -; ProjectName: ARTIQ/SINARA
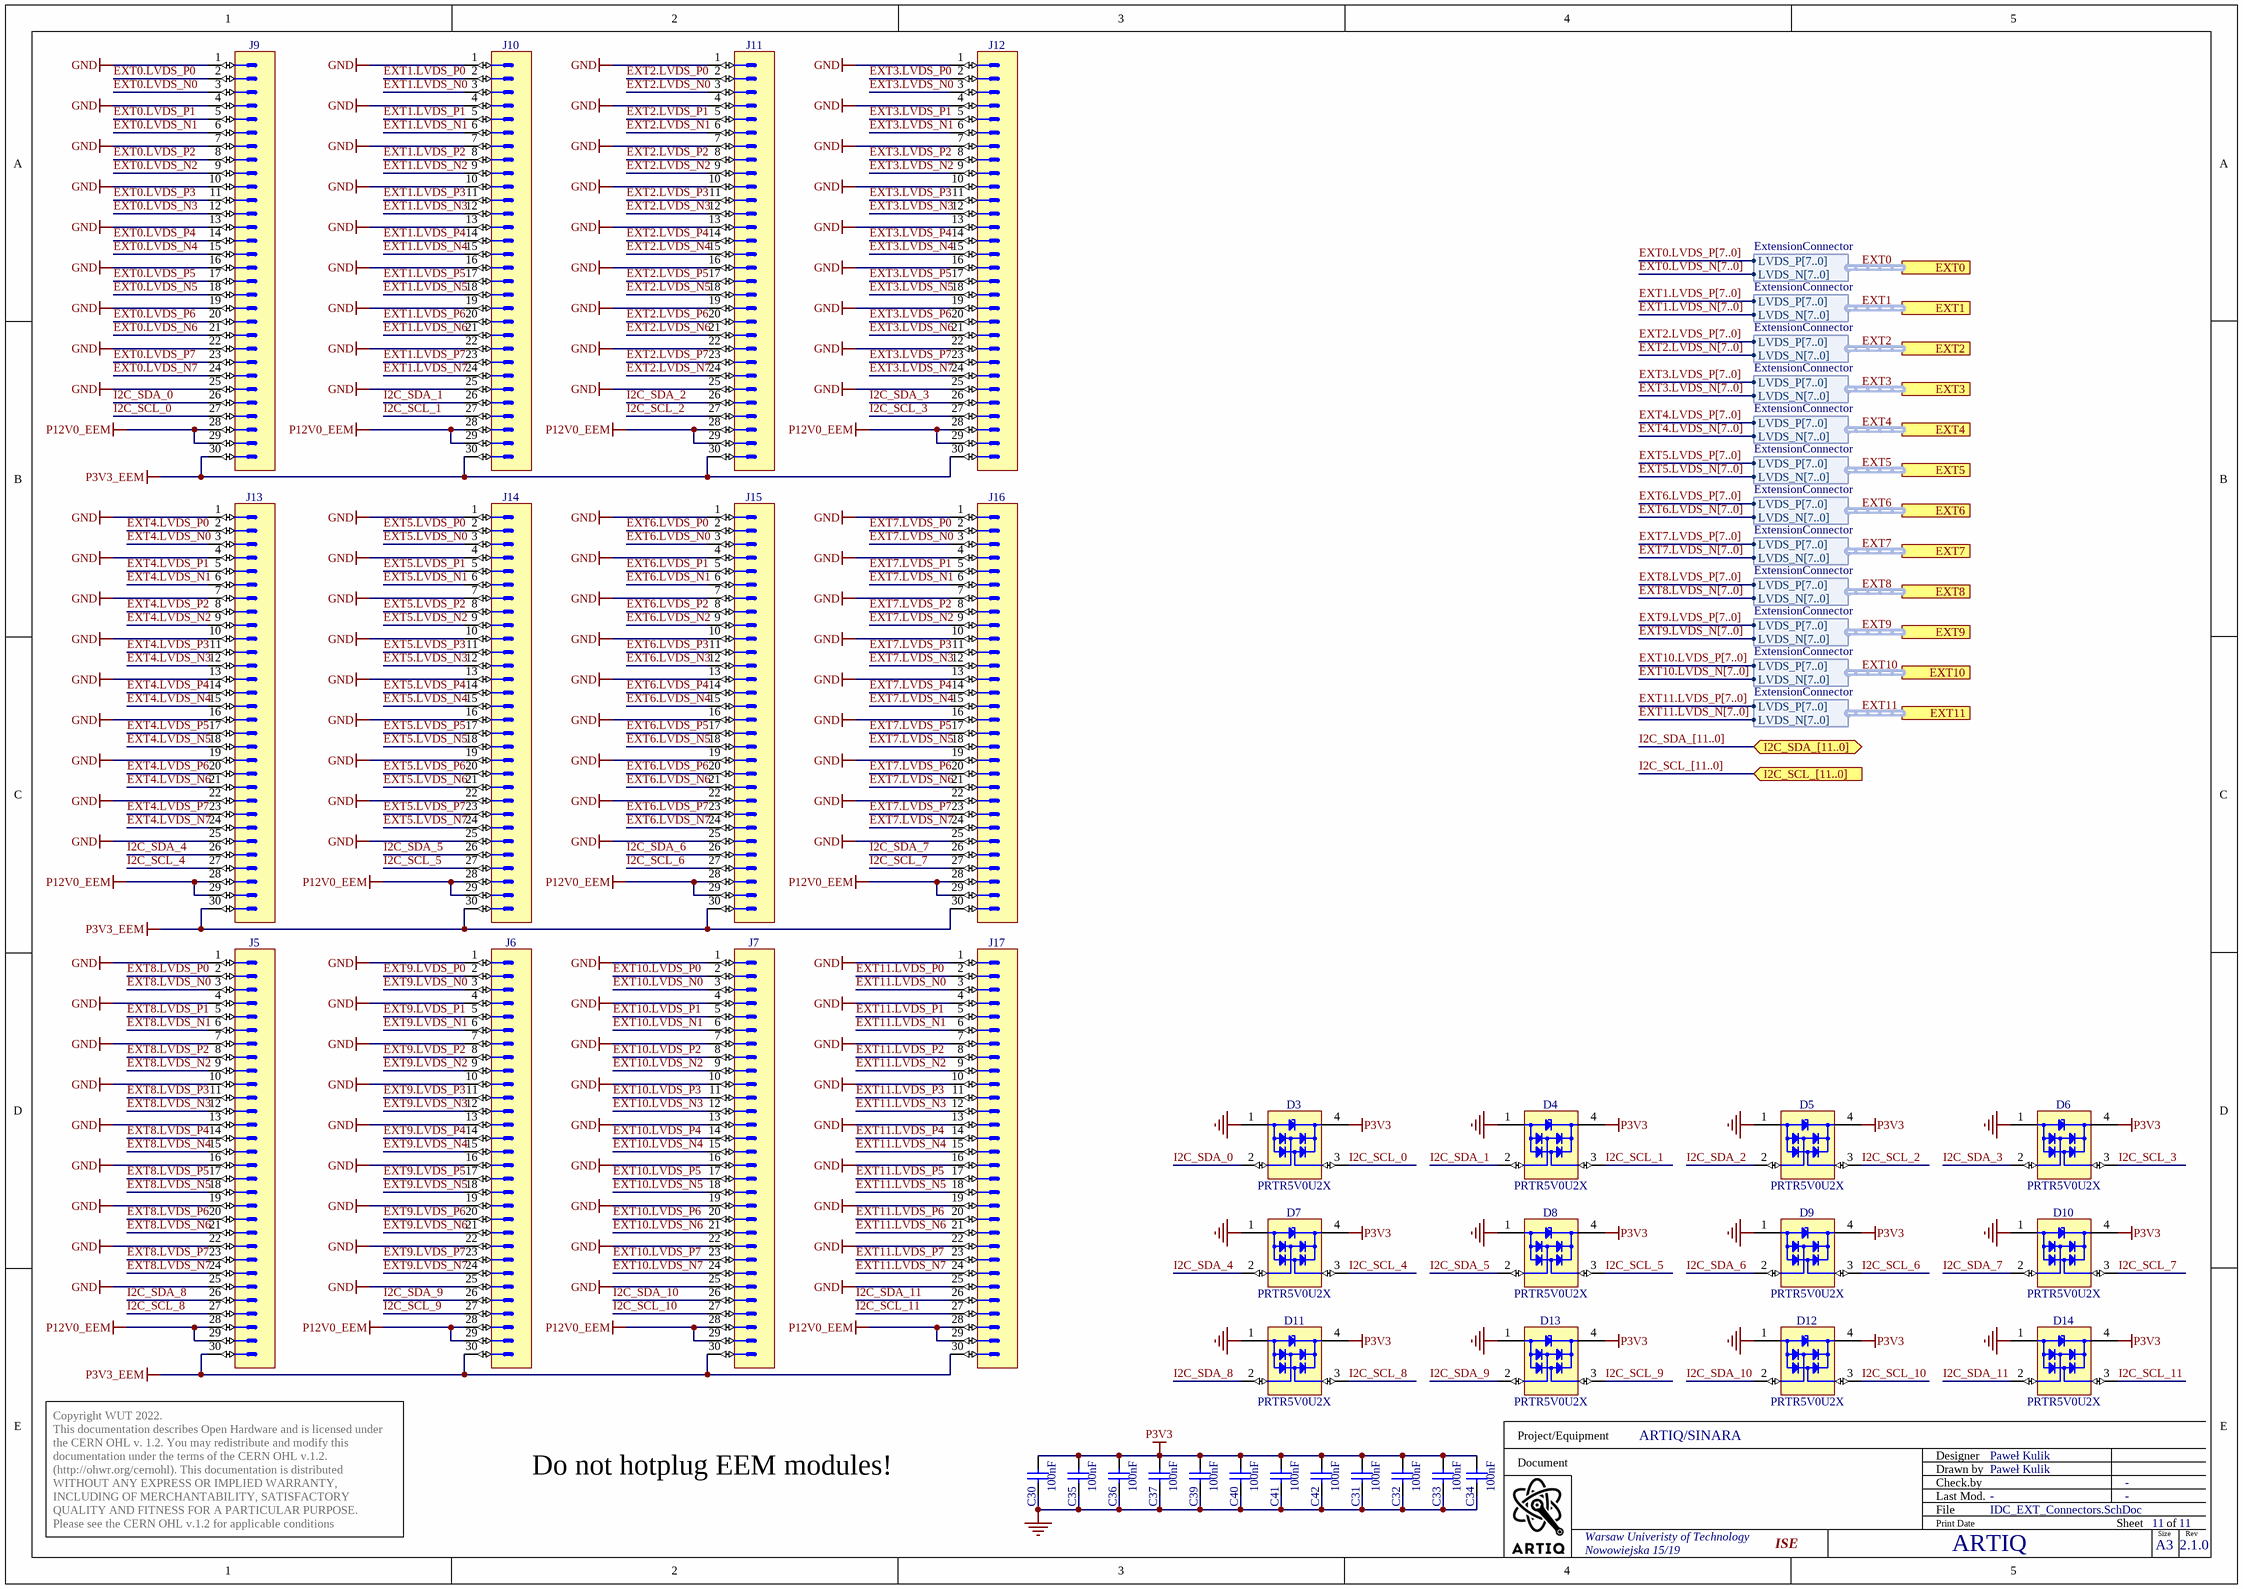
[diagram p9: IDC_EXT_Connectors.SchDoc]

### Parts
C30  100nF  [CAPC0603X33N]
C31  100nF  [CAPC0603X33N]
C32  100nF  [CAPC0603X33N]
C33  100nF  [CAPC0603X33N]
C34  100nF  [CAPC0603X33N]
C35  100nF  [CAPC0603X33N]
C36  100nF  [CAPC0603X33N]
C37  100nF  [CAPC0603X33N]
C39  100nF  [CAPC0603X33N]
C40  100nF  [CAPC0603X33N]
C41  100nF  [CAPC0603X33N]
C42  100nF  [CAPC0603X33N]
D3  PRTR5V0U2X  [SOT190P230X110-4N]
D4  PRTR5V0U2X  [SOT190P230X110-4N]
D5  PRTR5V0U2X  [SOT190P230X110-4N]
D6  PRTR5V0U2X  [SOT190P230X110-4N]
D7  PRTR5V0U2X  [SOT190P230X110-4N]
D8  PRTR5V0U2X  [SOT190P230X110-4N]
D9  PRTR5V0U2X  [SOT190P230X110-4N]
D10  PRTR5V0U2X  [SOT190P230X110-4N]
D11  PRTR5V0U2X  [SOT190P230X110-4N]
D12  PRTR5V0U2X  [SOT190P230X110-4N]
D13  PRTR5V0U2X  [SOT190P230X110-4N]
D14  PRTR5V0U2X  [SOT190P230X110-4N]
J5  (no value)  [3M_N2530-6002RB]
J6  (no value)  [3M_N2530-6002RB]
J7  (no value)  [3M_N2530-6002RB]
J9  (no value)  [3M_N2530-6002RB]
J10  (no value)  [3M_N2530-6002RB]
J11  (no value)  [3M_N2530-6002RB]
J12  (no value)  [3M_N2530-6002RB]
J13  (no value)  [3M_N2530-6002RB]
J14  (no value)  [3M_N2530-6002RB]
J15  (no value)  [3M_N2530-6002RB]
J16  (no value)  [3M_N2530-6002RB]
J17  (no value)  [3M_N2530-6002RB]

### Ports
EXT0 (harness ExtensionConnector), EXT1 (harness ExtensionConnector), EXT2 (harness ExtensionConnector), EXT3 (harness ExtensionConnector), EXT4 (harness ExtensionConnector), EXT5 (harness ExtensionConnector), EXT6 (harness ExtensionConnector), EXT7 (harness ExtensionConnector), EXT8 (harness ExtensionConnector), EXT9 (harness ExtensionConnector), EXT10 (harness ExtensionConnector), EXT11 (harness ExtensionConnector), I2C_SCL_[11..0] (in), I2C_SDA_[11..0] (bidir)

### Harnesses
ExtensionConnector: LVDS_N[7..0], LVDS_P[7..0]

### Nets
GND: C30.1 C31.1 C32.1 C33.1 C34.1 C35.1 C36.1 C37.1 C39.1 C40.1 C41.1 C42.1 D3.1(GND) D4.1(GND) D5.1(GND) D6.1(GND) D7.1(GND) D8.1(GND) D9.1(GND) D10.1(GND) D11.1(GND) D12.1(GND) D13.1(GND) D14.1(GND) J5.1 J5.4 J5.7 J5.10 J5.13 J5.16 J5.19 J5.22 J5.25 J6.1 J6.4 J6.7 J6.10 J6.13 J6.16 J6.19 J6.22 J6.25 J7.1 J7.4 J7.7 J7.10 J7.13 J7.16 J7.19 J7.22 J7.25 J9.1 J9.4 J9.7 J9.10 J9.13 J9.16 J9.19 J9.22 J9.25 J10.1 J10.4 J10.7 J10.10 J10.13 J10.16 J10.19 J10.22 J10.25 J11.1 J11.4 J11.7 J11.10 J11.13 J11.16 J11.19 J11.22 J11.25 J12.1 J12.4 J12.7 J12.10 J12.13 J12.16 J12.19 J12.22 J12.25 J13.1 J13.4 J13.7 J13.10 J13.13 J13.16 J13.19 J13.22 J13.25 J14.1 J14.4 J14.7 J14.10 J14.13 J14.16 J14.19 J14.22 J14.25 J15.1 J15.4 J15.7 J15.10 J15.13 J15.16 J15.19 J15.22 J15.25 J16.1 J16.4 J16.7 J16.10 J16.13 J16.16 J16.19 J16.22 J16.25 J17.1 J17.4 J17.7 J17.10 J17.13 J17.16 J17.19 J17.22 J17.25
P3V3: C30.2 C31.2 C32.2 C33.2 C34.2 C35.2 C36.2 C37.2 C39.2 C40.2 C41.2 C42.2 D3.4(VCC) D4.4(VCC) D5.4(VCC) D6.4(VCC) D7.4(VCC) D8.4(VCC) D9.4(VCC) D10.4(VCC) D11.4(VCC) D12.4(VCC) D13.4(VCC) D14.4(VCC)
P3V3_EEM: J5.30 J6.30 J7.30 J9.30 J10.30 J11.30 J12.30 J13.30 J14.30 J15.30 J16.30 J17.30
P12V0_EEM: J5.28 J5.29 J6.28 J6.29 J7.28 J7.29 J9.28 J9.29 J10.28 J10.29 J11.28 J11.29 J12.28 J12.29 J13.28 J13.29 J14.28 J14.29 J15.28 J15.29 J16.28 J16.29 J17.28 J17.29
EXT0.LVDS_N0: J9.3
EXT0.LVDS_N1: J9.6
EXT0.LVDS_N2: J9.9
EXT0.LVDS_N3: J9.12
EXT0.LVDS_N4: J9.15
EXT0.LVDS_N5: J9.18
EXT0.LVDS_N6: J9.21
EXT0.LVDS_N7: J9.24
EXT0.LVDS_P0: J9.2
EXT0.LVDS_P1: J9.5
EXT0.LVDS_P2: J9.8
EXT0.LVDS_P3: J9.11
EXT0.LVDS_P4: J9.14
EXT0.LVDS_P5: J9.17
EXT0.LVDS_P6: J9.20
EXT0.LVDS_P7: J9.23
EXT1.LVDS_N0: J10.3
EXT1.LVDS_N1: J10.6
EXT1.LVDS_N2: J10.9
EXT1.LVDS_N3: J10.12
EXT1.LVDS_N4: J10.15
EXT1.LVDS_N5: J10.18
EXT1.LVDS_N6: J10.21
EXT1.LVDS_N7: J10.24
EXT1.LVDS_P0: J10.2
EXT1.LVDS_P1: J10.5
EXT1.LVDS_P2: J10.8
EXT1.LVDS_P3: J10.11
EXT1.LVDS_P4: J10.14
EXT1.LVDS_P5: J10.17
EXT1.LVDS_P6: J10.20
EXT1.LVDS_P7: J10.23
EXT2.LVDS_N0: J11.3
EXT2.LVDS_N1: J11.6
EXT2.LVDS_N2: J11.9
EXT2.LVDS_N3: J11.12
EXT2.LVDS_N4: J11.15
EXT2.LVDS_N5: J11.18
EXT2.LVDS_N6: J11.21
EXT2.LVDS_N7: J11.24
EXT2.LVDS_P0: J11.2
EXT2.LVDS_P1: J11.5
EXT2.LVDS_P2: J11.8
EXT2.LVDS_P3: J11.11
EXT2.LVDS_P4: J11.14
EXT2.LVDS_P5: J11.17
EXT2.LVDS_P6: J11.20
EXT2.LVDS_P7: J11.23
EXT3.LVDS_N0: J12.3
EXT3.LVDS_N1: J12.6
EXT3.LVDS_N2: J12.9
EXT3.LVDS_N3: J12.12
EXT3.LVDS_N4: J12.15
EXT3.LVDS_N5: J12.18
EXT3.LVDS_N6: J12.21
EXT3.LVDS_N7: J12.24
EXT3.LVDS_P0: J12.2
EXT3.LVDS_P1: J12.5
EXT3.LVDS_P2: J12.8
EXT3.LVDS_P3: J12.11
EXT3.LVDS_P4: J12.14
EXT3.LVDS_P5: J12.17
EXT3.LVDS_P6: J12.20
EXT3.LVDS_P7: J12.23
EXT4.LVDS_N0: J13.3
EXT4.LVDS_N1: J13.6
EXT4.LVDS_N2: J13.9
EXT4.LVDS_N3: J13.12
EXT4.LVDS_N4: J13.15
EXT4.LVDS_N5: J13.18
EXT4.LVDS_N6: J13.21
EXT4.LVDS_N7: J13.24
EXT4.LVDS_P0: J13.2
EXT4.LVDS_P1: J13.5
EXT4.LVDS_P2: J13.8
EXT4.LVDS_P3: J13.11
EXT4.LVDS_P4: J13.14
EXT4.LVDS_P5: J13.17
EXT4.LVDS_P6: J13.20
EXT4.LVDS_P7: J13.23
EXT5.LVDS_N0: J14.3
EXT5.LVDS_N1: J14.6
EXT5.LVDS_N2: J14.9
EXT5.LVDS_N3: J14.12
EXT5.LVDS_N4: J14.15
EXT5.LVDS_N5: J14.18
EXT5.LVDS_N6: J14.21
EXT5.LVDS_N7: J14.24
EXT5.LVDS_P0: J14.2
EXT5.LVDS_P1: J14.5
EXT5.LVDS_P2: J14.8
EXT5.LVDS_P3: J14.11
EXT5.LVDS_P4: J14.14
EXT5.LVDS_P5: J14.17
EXT5.LVDS_P6: J14.20
EXT5.LVDS_P7: J14.23
EXT6.LVDS_N0: J15.3
EXT6.LVDS_N1: J15.6
EXT6.LVDS_N2: J15.9
EXT6.LVDS_N3: J15.12
EXT6.LVDS_N4: J15.15
EXT6.LVDS_N5: J15.18
EXT6.LVDS_N6: J15.21
EXT6.LVDS_N7: J15.24
EXT6.LVDS_P0: J15.2
EXT6.LVDS_P1: J15.5
EXT6.LVDS_P2: J15.8
EXT6.LVDS_P3: J15.11
EXT6.LVDS_P4: J15.14
EXT6.LVDS_P5: J15.17
EXT6.LVDS_P6: J15.20
EXT6.LVDS_P7: J15.23
EXT7.LVDS_N0: J16.3
EXT7.LVDS_N1: J16.6
EXT7.LVDS_N2: J16.9
EXT7.LVDS_N3: J16.12
EXT7.LVDS_N4: J16.15
EXT7.LVDS_N5: J16.18
EXT7.LVDS_N6: J16.21
EXT7.LVDS_N7: J16.24
EXT7.LVDS_P0: J16.2
EXT7.LVDS_P1: J16.5
EXT7.LVDS_P2: J16.8
EXT7.LVDS_P3: J16.11
EXT7.LVDS_P4: J16.14
EXT7.LVDS_P5: J16.17
EXT7.LVDS_P6: J16.20
EXT7.LVDS_P7: J16.23
EXT8.LVDS_N0: J5.3
EXT8.LVDS_N1: J5.6
EXT8.LVDS_N2: J5.9
EXT8.LVDS_N3: J5.12
EXT8.LVDS_N4: J5.15
EXT8.LVDS_N5: J5.18
EXT8.LVDS_N6: J5.21
EXT8.LVDS_N7: J5.24
EXT8.LVDS_P0: J5.2
EXT8.LVDS_P1: J5.5
EXT8.LVDS_P2: J5.8
EXT8.LVDS_P3: J5.11
EXT8.LVDS_P4: J5.14
EXT8.LVDS_P5: J5.17
EXT8.LVDS_P6: J5.20
EXT8.LVDS_P7: J5.23
EXT9.LVDS_N0: J6.3
EXT9.LVDS_N1: J6.6
EXT9.LVDS_N2: J6.9
EXT9.LVDS_N3: J6.12
EXT9.LVDS_N4: J6.15
EXT9.LVDS_N5: J6.18
EXT9.LVDS_N6: J6.21
EXT9.LVDS_N7: J6.24
EXT9.LVDS_P0: J6.2
EXT9.LVDS_P1: J6.5
EXT9.LVDS_P2: J6.8
EXT9.LVDS_P3: J6.11
EXT9.LVDS_P4: J6.14
EXT9.LVDS_P5: J6.17
EXT9.LVDS_P6: J6.20
EXT9.LVDS_P7: J6.23
EXT10.LVDS_N0: J7.3
EXT10.LVDS_N1: J7.6
EXT10.LVDS_N2: J7.9
EXT10.LVDS_N3: J7.12
EXT10.LVDS_N4: J7.15
EXT10.LVDS_N5: J7.18
EXT10.LVDS_N6: J7.21
EXT10.LVDS_N7: J7.24
EXT10.LVDS_P0: J7.2
EXT10.LVDS_P1: J7.5
EXT10.LVDS_P2: J7.8
EXT10.LVDS_P3: J7.11
EXT10.LVDS_P4: J7.14
EXT10.LVDS_P5: J7.17
EXT10.LVDS_P6: J7.20
EXT10.LVDS_P7: J7.23
EXT11.LVDS_N0: J17.3
EXT11.LVDS_N1: J17.6
EXT11.LVDS_N2: J17.9
EXT11.LVDS_N3: J17.12
EXT11.LVDS_N4: J17.15
EXT11.LVDS_N5: J17.18
EXT11.LVDS_N6: J17.21
EXT11.LVDS_N7: J17.24
EXT11.LVDS_P0: J17.2
EXT11.LVDS_P1: J17.5
EXT11.LVDS_P2: J17.8
EXT11.LVDS_P3: J17.11
EXT11.LVDS_P4: J17.14
EXT11.LVDS_P5: J17.17
EXT11.LVDS_P6: J17.20
EXT11.LVDS_P7: J17.23
I2C_SCL_0: D3.3(I/O2) J9.27
I2C_SCL_1: D4.3(I/O2) J10.27
I2C_SCL_2: D5.3(I/O2) J11.27
I2C_SCL_3: D6.3(I/O2) J12.27
I2C_SCL_4: D7.3(I/O2) J13.27
I2C_SCL_5: D8.3(I/O2) J14.27
I2C_SCL_6: D9.3(I/O2) J15.27
I2C_SCL_7: D10.3(I/O2) J16.27
I2C_SCL_8: D11.3(I/O2) J5.27
I2C_SCL_9: D13.3(I/O2) J6.27
I2C_SCL_10: D12.3(I/O2) J7.27
I2C_SCL_11: D14.3(I/O2) J17.27
I2C_SDA_0: D3.2(I/O1) J9.26
I2C_SDA_1: D4.2(I/O1) J10.26
I2C_SDA_2: D5.2(I/O1) J11.26
I2C_SDA_3: D6.2(I/O1) J12.26
I2C_SDA_4: D7.2(I/O1) J13.26
I2C_SDA_5: D8.2(I/O1) J14.26
I2C_SDA_6: D9.2(I/O1) J15.26
I2C_SDA_7: D10.2(I/O1) J16.26
I2C_SDA_8: D11.2(I/O1) J5.26
I2C_SDA_9: D13.2(I/O1) J6.26
I2C_SDA_10: D12.2(I/O1) J7.26
I2C_SDA_11: D14.2(I/O1) J17.26

### Buses and harness runs
bus EXT0.LVDS_N[7..0]
bus EXT0.LVDS_P[7..0]
bus EXT1.LVDS_N[7..0]
bus EXT1.LVDS_P[7..0]
bus EXT2.LVDS_N[7..0]
bus EXT2.LVDS_P[7..0]
bus EXT3.LVDS_N[7..0]
bus EXT3.LVDS_P[7..0]
bus EXT4.LVDS_N[7..0]
bus EXT4.LVDS_P[7..0]
bus EXT5.LVDS_N[7..0]
bus EXT5.LVDS_P[7..0]
bus EXT6.LVDS_N[7..0]
bus EXT6.LVDS_P[7..0]
bus EXT7.LVDS_N[7..0]
bus EXT7.LVDS_P[7..0]
bus EXT8.LVDS_N[7..0]
bus EXT8.LVDS_P[7..0]
bus EXT9.LVDS_N[7..0]
bus EXT9.LVDS_P[7..0]
bus EXT10.LVDS_N[7..0]
bus EXT10.LVDS_P[7..0]
bus EXT11.LVDS_N[7..0]
bus EXT11.LVDS_P[7..0]
bus I2C_SCL_[11..0] = port I2C_SCL_[11..0]
bus I2C_SDA_[11..0] = port I2C_SDA_[11..0]
harness EXT0 = port EXT0
harness EXT1 = port EXT1
harness EXT2 = port EXT2
harness EXT3 = port EXT3
harness EXT4 = port EXT4
harness EXT5 = port EXT5
harness EXT6 = port EXT6
harness EXT7 = port EXT7
harness EXT8 = port EXT8
harness EXT9 = port EXT9
harness EXT10 = port EXT10
harness EXT11 = port EXT11

### Notes on the sheet
- Do not hotplug EEM modules!
- Project/Equipment
- Document
- Designer
- Drawn by
- Check.by
- Copyright WUT 2022.
  This documentation describes Open Hardware and is licensed under the CERN OHL v. 1.2. You may redistribute and modify this documentation under the terms of the CERN OHL v.1.2. (http://ohwr.org/cernohl). This documentation is distributed WITHOUT ANY EXPRESS OR IMPLIED WARRANTY, INCLUDING OF MERCHANTABILITY, SATISFACTORY QUALITY AND FITNESS FOR A PARTICULAR PURPOSE. Please see the CERN OHL v.1.2 for applicable conditions
- File
- Last Mod.
- Print Date
- Sheet
- Size
- A3
- of
- Rev

### Library data of the parts
C30-C37 C39-C42 = CC0201_100NF_6.3V_10%_X5R: Non-polarised capacitor; Part Description: SMD Multilayer Chip Ceramic Capacitor; Manufacturer: GENERIC; Manufacturer1 Part Number: 02016D104KAT2A; Voltage: 6.3V; TC: X5R; Tolerance: ±10%; Part Number: CC0201_100NF_6.3V_10%_X5R; Component Kind: Standard; Component Type: Standard; Pin Count: 2; Value: 100nF; Status: Not Recommended; Manufacturer Part Number: CC0201_100NF_6.3V_10%_X5R; Case: 0201; Mounted: Yes; Socket: No; SMD: Yes; Sense: No; Manufacturer1 Example: AVX; Manufacturer1 ComponentHeight: 0.33mm; HelpURL: \\cern.ch\dfs\Applications\Altium\Datasheets\CC0201_X5R_AVX.pdf; Author: CERN DEM JLC; CreateDate: 2007-12-03; LatestRevisionDate: 2007-12-03
D3-D14 = PRTR5V0U2X: Ultra Low Capacitance Double Rail-to-Rail ESD Protection Diode; Part Description: Ultra Low Capacitance (1pF) Double Rail-to-Rail ESD Protection Diode (8kV); Manufacturer: NXP SEMICONDUCTORS; Voltage: 5.5V; PressFit: No; Bonding: No; Part Number: PRTR5V0U2X; Component Kind: Standard; Component Type: Standard; Device: PRTR5V0U2X; PackageDescription: SOT143B, SOT, 1.90mm Pitch; 4 Pin, 1.30mm W X 2.90mm L X 1.10mm H body, IPC Medium Density; Manufacturer Part Number: PRTR5V0U2X; Pin Count: 4; Case: SOT143B; Mounted: Yes; Socket: No; SMD: Yes; Sense: No; ComponentHeight: 1.1mm; HelpURL: \\cern.ch\dfs\Applications\Altium\Datasheets\PRTR5V0U2X.pdf; Author: CERN DEM JLC; CreateDate: 22.03.2011; LatestRevisionDate: 22.03.2011
J5-J7 J9-J17 = 3M_N2530-6002RB: Connector 30 Male; Part Description: 30 Contacts - Straight .100'' x .100'' Low Profile Four-Wall Header, 2500 Series; Manufacturer: 3M; PressFit: No; Part Number: 3M_N2530-6002RB; Component Kind: Standard; Component Type: Standard; Pin Count: 30; Family: Header 30; Mounted: Yes; Socket: No; SMD: No; Sense: No; Status: None; Manufacturer Part Number: N2530-6002RB; ComponentHeight: 10.03mm; HelpURL: \\cern.ch\dfs\Applications\Altium\Datasheets\3M_N2530-6002RB.pdf; Author: CERN DEM JLC; CreateDate: 11.02.2009; LatestRevisionDate: 11.08.2009